# Altium project CLP.PrjPCB
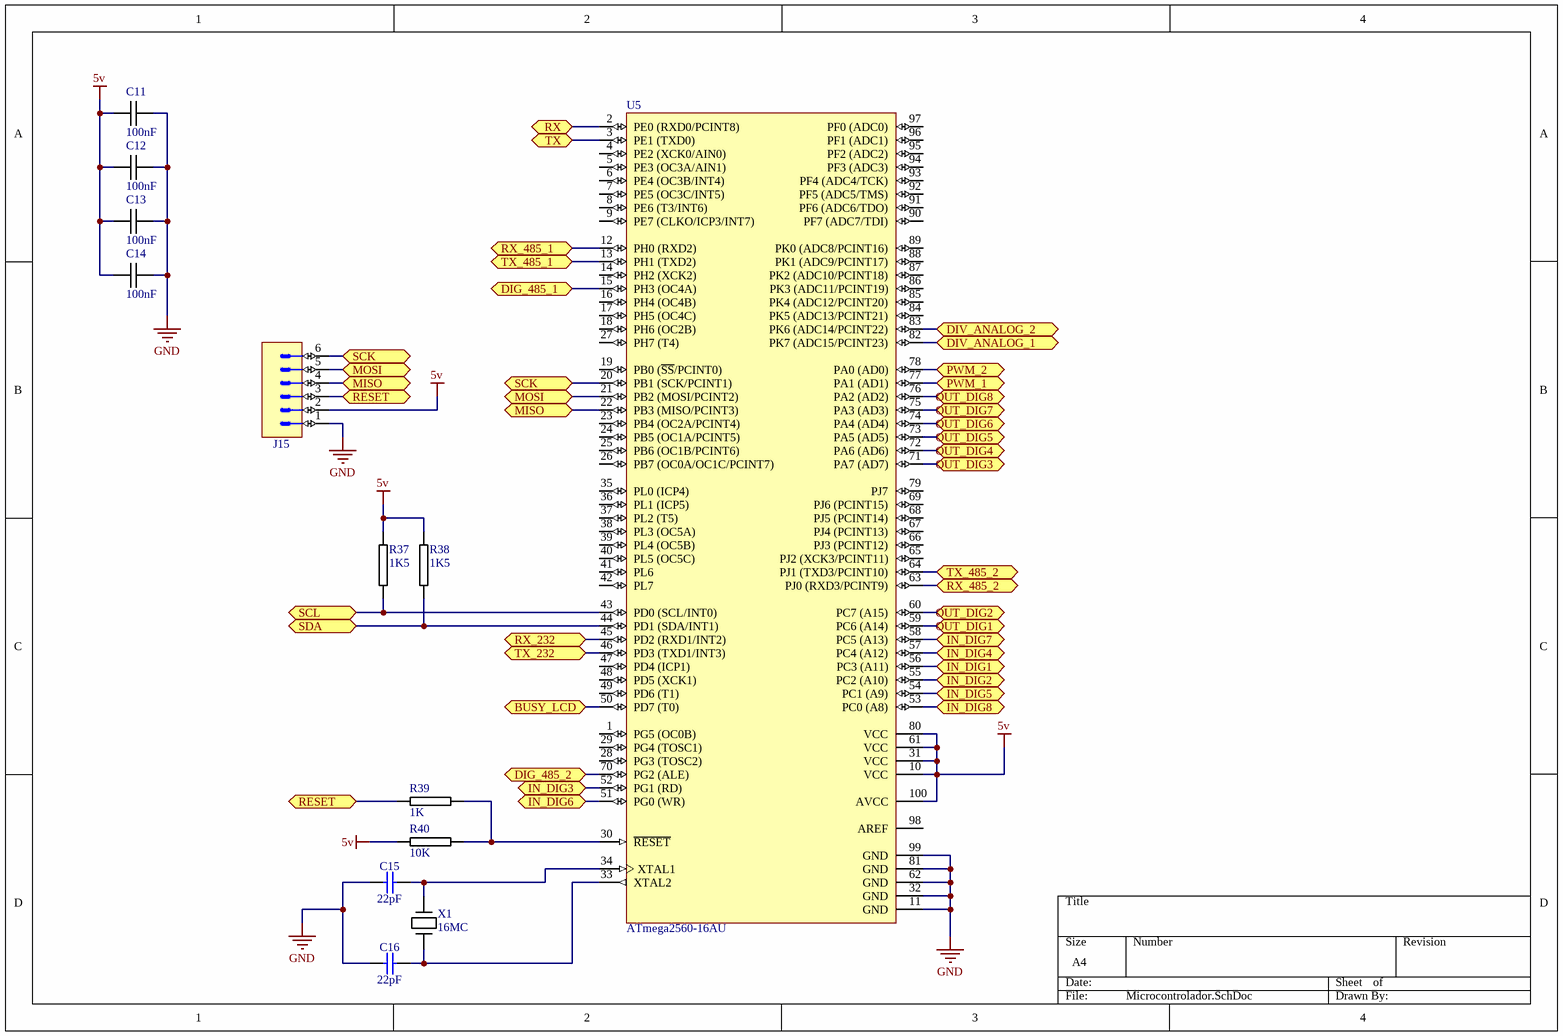
[diagram p0: Microcontrolador.SchDoc]
11 sheets, 159 parts. Net scope: flat (ports and power ports of the same name join across sheets).
Board file: CLP_007.PcbDoc
Sheets:
  Microcontrolador.SchDoc
  Alimentacao.SchDoc
  Output_dig.SchDoc
  Output_dig2.SchDoc
  Input_dig.SchDoc
  Comu_485.SchDoc
  USB_SERIAL.SchDoc
  eeprom24c32.SchDoc
  RTC_ds1307z.SchDoc
  analog.SchDoc
  conn.SchDoc

## Sheet Microcontrolador.SchDoc
size A4; DocumentNumber: 1; SheetNumber: 1; SheetTotal: 11

### Parts
C11  100nF  [0805C-TBD]
C12  100nF  [0805C-TBD]
C13  100nF  [0805C-TBD]
C14  100nF  [0805C-TBD]
C15  22pF  [CAPC2012X135N]
C16  22pF  [CAPC2012X135N]
J15  KK®  [MOLEX_22-27-2061]  (value not drawn)
R37  1K5  [0805R-1K5]
R38  1K5  [0805R-1K5]
R39  1K  [0805R-1K]
R40  10K  [0805R-10K]
U5  ATmega2560-16AU  [100A_N]
X1  16MC  [XTAL-RU49/4]

### Ports
BUSY_LCD, DIG_485_1 (bidir), DIG_485_2 (bidir), DIV_ANALOG_1, DIV_ANALOG_2, IN_DIG1, IN_DIG2, IN_DIG3, IN_DIG4, IN_DIG5, IN_DIG6, IN_DIG7, IN_DIG8, MISO, MOSI, OUT_DIG1, OUT_DIG2, OUT_DIG3, OUT_DIG4, OUT_DIG5, OUT_DIG6, OUT_DIG7, OUT_DIG8, PWM_1, PWM_2, RESET, RX, RX_232, RX_485_1, RX_485_2, SCK, SCL, SDA, TX, TX_232, TX_485_1 (bidir), TX_485_2 (bidir)

### Nets
5v: C11.1 C12.1 C13.1 C14.1 J15.2 R37.1 R38.1 R40.1 U5.10(VCC) U5.31(VCC) U5.61(VCC) U5.80(VCC) U5.100(AVCC)
GND: C11.2 C12.2 C13.2 C14.2 C15.1 C16.1 J15.1 U5.11(GND) U5.32(GND) U5.62(GND) U5.81(GND) U5.99(GND)
NetC15_2: C15.2 U5.34(XTAL1) X1.1
NetC16_2: C16.2 U5.33(XTAL2) X1.2
NetC19_2: J15.3 R39.1 ; port RESET
NetIC2_6: U5.56(PC3_(A11)) ; port IN_DIG1
NetIC3_6: U5.54(PC1_(A9)) ; port IN_DIG5
NetIC4_6: U5.55(PC2_(A10)) ; port IN_DIG2
NetIC5_6: U5.51(PG0_(WR)) ; port IN_DIG6
NetIC6_6: U5.52(PG1_(RD)) ; port IN_DIG3
NetIC7_6: U5.58(PC5_(A13)) ; port IN_DIG7
NetIC8_6: U5.57(PC4_(A12)) ; port IN_DIG4
NetIC9_6: U5.53(PC0_(A8)) ; port IN_DIG8
NetIC12_1: U5.59(PC6_(A14)) ; port OUT_DIG1
NetIC12_3: U5.60(PC7_(A15)) ; port OUT_DIG2
NetIC12_5: U5.71(PA7_(AD7)) ; port OUT_DIG3
NetIC12_9: U5.72(PA6_(AD6)) ; port OUT_DIG4
NetIC21_1: U5.73(PA5_(AD5)) ; port OUT_DIG5
NetIC21_3: U5.74(PA4_(AD4)) ; port OUT_DIG6
NetIC21_5: U5.75(PA3_(AD3)) ; port OUT_DIG7
NetIC21_9: U5.76(PA2_(AD2)) ; port OUT_DIG8
NetJ6_7: U5.50(PD7_(T0)) ; port BUSY_LCD
NetJ15_4: J15.4 U5.22(PB3_(MISO/PCINT3)) ; port MISO
NetJ15_5: J15.5 U5.21(PB2_(MOSI/PCINT2)) ; port MOSI
NetJ15_6: J15.6 U5.20(PB1_(SCK/PCINT1)) ; port SCK
NetR6_1: U5.46(PD3_(TXD1/INT3)) ; port TX_232
NetR10_1: U5.45(PD2_(RXD1/INT2)) ; port RX_232
NetR37_2: R37.2 U5.43(PD0_(SCL/INT0)) ; port SCL
NetR38_2: R38.2 U5.44(PD1_(SDA/INT1)) ; port SDA
NetR39_2: R39.2 R40.2 U5.30(~{RESET})
NetR54_2: U5.2(PE0_(RXD0/PCINT8)) ; port RX
NetR56_2: U5.3(PE1_(TXD0)) ; port TX
NetR58_1: U5.77(PA1_(AD1)) ; port PWM_1
NetR61_1: U5.78(PA0_(AD0)) ; port PWM_2
NetR62_1: U5.82(PK7_(ADC15/PCINT23)) ; port DIV_ANALOG_1
NetR63_1: U5.83(PK6_(ADC14/PCINT22)) ; port DIV_ANALOG_2
NetU2_1: U5.12(PH0_(RXD2)) ; port RX_485_1
NetU2_2: U5.15(PH3_(OC4A)) ; port DIG_485_1
NetU2_4: U5.13(PH1_(TXD2)) ; port TX_485_1
NetU3_1: U5.63(PJ0_(RXD3/PCINT9)) ; port RX_485_2
NetU3_2: U5.70(PG2_(ALE)) ; port DIG_485_2
NetU3_4: U5.64(PJ1_(TXD3/PCINT10)) ; port TX_485_2

Not connected (* = marked no-connect by the designer): U5 1(PG5_(OC0B)) 4(PE2_(XCK0/AIN0)) 5(PE3_(OC3A/AIN1)) 6(PE4_(OC3B/INT4)) 7(PE5_(OC3C/INT5)) 8(PE6_(T3/INT6)) 9(PE7_(CLKO/ICP3/INT7)) 14(PH2_(XCK2)) 16(PH4_(OC4B)) 17(PH5_(OC4C)) 18(PH6_(OC2B)) 19(PB0_(~{SS}/PCINT0)) 23(PB4_(OC2A/PCINT4)) 24(PB5_(OC1A/PCINT5)) 25(PB6_(OC1B/PCINT6)) 26(PB7_(OC0A/OC1C/PCINT7)) 27(PH7_(T4)) 28(PG3_(TOSC2)) 29(PG4_(TOSC1)) 35(PL0_(ICP4)) 36(PL1_(ICP5)) 37(PL2_(T5)) 38(PL3_(OC5A)) 39(PL4_(OC5B)) 40(PL5_(OC5C)) 41(PL6) 42(PL7) 47(PD4_(ICP1)) 48(PD5_(XCK1)) 49(PD6_(T1)) 65(PJ2_(XCK3/PCINT11)) 66(PJ3_(PCINT12)) 67(PJ4_(PCINT13)) 68(PJ5_(PCINT14)) 69(PJ6_(PCINT15)) 79(PJ7) 84(PK5_(ADC13/PCINT21)) 85(PK4_(ADC12/PCINT20)) 86(PK3_(ADC11/PCINT19)) 87(PK2_(ADC10/PCINT18)) 88(PK1_(ADC9/PCINT17)) 89(PK0_(ADC8/PCINT16)) 90(PF7_(ADC7/TDI)) 91(PF6_(ADC6/TDO)) 92(PF5_(ADC5/TMS)) 93(PF4_(ADC4/TCK)) 94(PF3_(ADC3)) 95(PF2_(ADC2)) 96(PF1_(ADC1)) 97(PF0_(ADC0)) 98(AREF)

### Library data of the parts
C11-C14 = 0805C-100nF-25V-X7R-MUR: CAPACITOR 0805 CERAMIC; Supplier 1: Digi-Key; Supplier Part Number 1: 490-1673-1-ND
C15 C16 = CC0805_22PF_50V_5%_NP0: Non-polarised capacitor; Part Description: SMD Multilayer Chip Ceramic Capacitor; Manufacturer: GENERIC; Manufacturer1 Part Number: 223886115229; Voltage: 50V; TC: NP0; Tolerance: ±5%; Table: Capacitors SMD; Part Number: CC0805_22PF_50V_5%_NP0; Component Kind: Standard; Component Type: Standard; Pin Count: 2; Value: 22pF; Status: Preferred; Manufacturer Part Number: CC0805_22PF_50V_5%_NP0; Case: 0805; Mounted: Yes; Socket: No; SMD: Yes; Manufacturer1 Example: PHYCOMP; Manufacturer1 ComponentHeight: 1.35mm; HelpURL: \\cern.ch\dfs\Applications\Altium\Datasheets\CC0805_NP0_PHYCOMP.pdf; Author: CERN DEM JLC; CreateDate: 03/12/2007; LatestRevisionDate: 03/12/2007
J15 = MOLEX_22-27-2061: Connector 6 Male; Part Description: 2.54mm (.100") Pitch KK® Wire-to-Board Header, Vertical, with Friction Lock, 6 Circuits, Tin (Sn) Plating; Manufacturer: MOLEX; Part Number: MOLEX_22-27-2061; Component Kind: Standard; Component Type: Standard; Pin Count: 6; Family: KK®; Mounted: Yes; Socket: No; SMD: No; Status: None; Manufacturer Part Number: 22-27-2061; ComponentHeight: 11.7mm; HelpURL: \\cern.ch\dfs\Applications\Altium\Datasheets\MOLEX_22-27-2061.pdf; Author: CERN DEM JMW; CreateDate: 30/11/2011; LatestRevisionDate: 30/11/2011; Table: MOLEX
R37 R38 = 0805R-1K5: RESISTOR 0805 1/4 WATT THIN FILM; Reel: *
R39 = 0805R-1K: RESISTOR 0805 1/4 WATT THIN FILM; Reel: *
R40 = 0805R-10K: RESISTOR 0805 1/4 WATT THIN FILM; Reel: *
U5 = ATmega2560-16AU: 8-bit AVR Microcontroller, 4.5-5.5V, 16MHz, 256KB Flash, 4KB EEPROM, 8KB SRAM, 86 GPIO pins, 100-pin TQFP, Industrial Grade (-40°C to 85°C), Pb-Free; DatasheetVersion: revN, May-2011; PackageVersion: revD, Oct-2010; PackageReference: 100A; PackageDescription: 100-Pin Thin Profile Plastic Quad Flat Pack (TQFP), 14 x 14 x 1.0 mm Body, 0.5 mm Pitch; Code_JEDEC: MS-026-AED; ComponentLink1Description: Manufacturer URL; ComponentLink1URL: http://www.atmel.com/; ComponentLink2Description: ATmega640/1280/1281/2560/2561 Datasheet; ComponentLink2URL: http://www.atmel.com/dyn/resources/prod_documents/doc2549.pdf; ComponentLink3Description: ATmega640/1280/1281/2560/2561 Summary; ComponentLink3URL: http://www.atmel.com/dyn/resources/prod_documents/2549S.pdf
X1 = 16MC-HC49US: 16MHZ CRSYTAL HC49US; Supplier 1: Mouser; Supplier Part Number 1: 815-ABLS-16.0M-T

## Sheet Alimentacao.SchDoc
size A4; DocumentNumber: 8; SheetNumber: 8; SheetTotal: 11
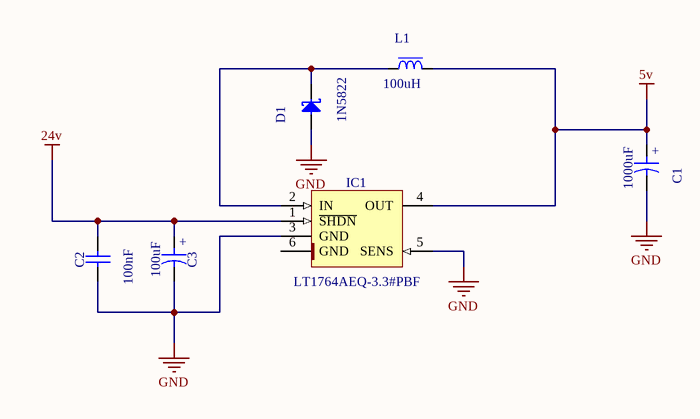
[diagram p1: Alimentacao.SchDoc]

### Parts
C1  1000uF  [CAPPR500-1350X2200]
C2  100nF  [CAPC2012X135N]
C3  100uF  [CAPPR500-1050X1750]
D1  1N5822  [DO-201AD]
IC1  LT1764AEQ-3.3#PBF  [TO170P1394X457-6N-R900X1060]
L1  100uH  [IND_WURTH_WE-PD4_L]

### Nets
5v: C1.1 IC1.4(OUT) L1.2
24v: C2.2 C3.1 IC1.1(~{SHDN})
GND: C1.2 C2.1 C3.2 D1.2(A) IC1.3(GND) IC1.5(SENS)
NetD1_1: D1.1(C) IC1.2(IN) L1.1

Not connected (* = marked no-connect by the designer): IC1 6(GND)

### Notes on the sheet
- (in symbol CAER_100UF_63V_20%_500-1050X1750_LESR0R190) +
- (in symbol CAER_1000UF_35V_20%_VISHAY_MAL203850102E3) +

### Library data of the parts
C1 = CAER_1000UF_35V_20%_VISHAY_MAL203850102E3: Polarised capacitor; Part Description: Radial Standard Ultra Miniature Aluminum Electrolytic Capacitor (038 RSU Series); Manufacturer: VISHAY BCCOMPONENTS; Voltage: 35V; Tolerance: ±20%; Table: Capacitors THD; Part Number: CAER_1000UF_35V_20%_VISHAY_MAL203850102E3; Component Kind: Standard; Component Type: Standard; Pin Count: 2; Value: 1000uF; Status: None; Manufacturer Part Number: MAL203850102E3; Case: LS5 D13.5 x H22; Mounted: Yes; Socket: No; SMD: No; ComponentHeight: 22mm; HelpURL: \\cern.ch\dfs\Applications\Altium\Datasheets\CAER_VISHAY_038 RSU.pdf; Author: CERN DEM JLC; CreateDate: 11/04/2012; LatestRevisionDate: 11/04/2012
C2 = CC0805_100NF_50V_10%_X7R: Non-polarised capacitor; Part Description: SMD Multilayer Chip Ceramic Capacitor; Manufacturer: GENERIC; Manufacturer1 Part Number: B37941K5104K62; Voltage: 50V; TC: X7R; Tolerance: ±10%; Table: Capacitors SMD; Part Number: CC0805_100NF_50V_10%_X7R; Component Kind: Standard; Component Type: Standard; Pin Count: 2; Value: 100nF; Status: Preferred; Manufacturer Part Number: CC0805_100NF_50V_10%_X7R; Case: 0805; Mounted: Yes; Socket: No; SMD: Yes; Manufacturer1 Example: EPCOS; Manufacturer1 ComponentHeight: 1.35mm; HelpURL: \\cern.ch\dfs\Applications\Altium\Datasheets\CC0805_X7R_EPCOS.pdf; Author: CERN DEM JLC; CreateDate: 03/12/2007; LatestRevisionDate: 03/12/2007
C3 = CAER_100UF_63V_20%_500-1050X1750_LESR0R190: Polarised capacitor; Part Description: Low ESR 0R190 Aluminum Electrolytic Capacitor; Manufacturer: VISHAY BCCOMPONENTS; Manufacturer Part Number: MAL213668101E3 Series 136RVI; Voltage: 63V; Tolerance: ±20%; Table: Capacitors THD; Part Number: CAER_100UF_63V_20%_500-1050X1750_LESR0R190; Component Kind: Standard; Component Type: Standard; Pin Count: 2; Value: 100uF; Status: Preferred; Case: LS5 D10.5 x H17.5; Mounted: Yes; Socket: No; SMD: No; ComponentHeight: 17.5mm; HelpURL: \\cern.ch\dfs\Applications\Altium\Datasheets\CAER-LESR_VISHAY_136RVI.pdf; Author: CERN DEM JLC; CreateDate: 03/07/2008; LatestRevisionDate: 16/03/2009
D1 = 1N5822: Schottky Diode; Part Description: Schottky Rectifier; Manufacturer: FAIRCHILD SEMICONDUCTOR; Voltage: 40V; Power: 3A; Table: Diodes; Part Number: 1N5822; Component Kind: Standard; Component Type: Standard; Device: 1N5822; PackageDescription: DO-201AD, Diode, Axial; Lead Spacing 20.32mm, Lead Dia. 1.3mm, Body Length 9.5mm, Body Dia. 5.6mm; Manufacturer Part Number: 1N5822; Pin Count: 2; Case: DO-201AD; Mounted: Yes; Socket: No; SMD: No; ComponentHeight: 5.6mm; HelpURL: \\cern.ch\dfs\Applications\Altium\Datasheets\1N5822.pdf; Author: CERN DEM JLC; CreateDate: 31/03/2009; LatestRevisionDate: 31/03/2009
IC1 = LT1764AEQ-3.3#PBF: 3A, Fast Transient Response, Low Noise, LDO Regulators; Manufacturer: LINEAR TECHNOLOGY; Part Number: LT1764AEQ-3.3#PBF; Component Kind: Standard; Component Type: Standard; Device: LT1764AEQ-3.3#PBF; PackageDescription: TO, 1.70mm Pitch; 5 Pin, 13.945mm L X 8.89mm W X 4.572mm H body, IPC Medium Density; Part Description: 3A, Fast Transient Response, Low Noise, LDO Regulators; Manufacturer Part Number: LT1764AEQ-3.3#PBF; Pin Count: 6; Case: TO-263; Mounted: Yes; Socket: No; SMD: Yes; ComponentHeight: 4.57mm; HelpURL: \\cern.ch\dfs\Applications\Altium\Datasheets\LT1764AEQ-3.3#PBF.pdf; Author: CERN DEM JLC; CreateDate: 27/03/2012; LatestRevisionDate: 27/03/2012; Table: Regulators
L1 = IND_3.3UH_20%_WURTH_WE-PD4_74456033: Inductor With Magnetic core; Part Description: Power Choke (WE-PD 4 Serie); Manufacturer: WURTH ELEKTRONIK; Value: 3.3uH; Power: 5.3A; Resistance: 0.015R; Tolerance: ±20%; Table: Inductors SMD; Part Number: IND_3.3UH_20%_WURTH_WE-PD4_74456033; Component Kind: Standard; Component Type: Standard; Pin Count: 2; Status: None; Manufacturer Part Number: 74456033; Mounted: Yes; Socket: No; SMD: Yes; ComponentHeight: 5.3mm; HelpURL: \\cern.ch\dfs\Applications\Altium\Datasheets\IND_WURTH_WE-PD4_74456033.pdf; Author: CERN DEM JLC; CreateDate: 07/06/2011; LatestRevisionDate: 24/01/2012

## Sheet Output_dig.SchDoc
size A4; DocumentNumber: 2; SheetNumber: 2; SheetTotal: 11
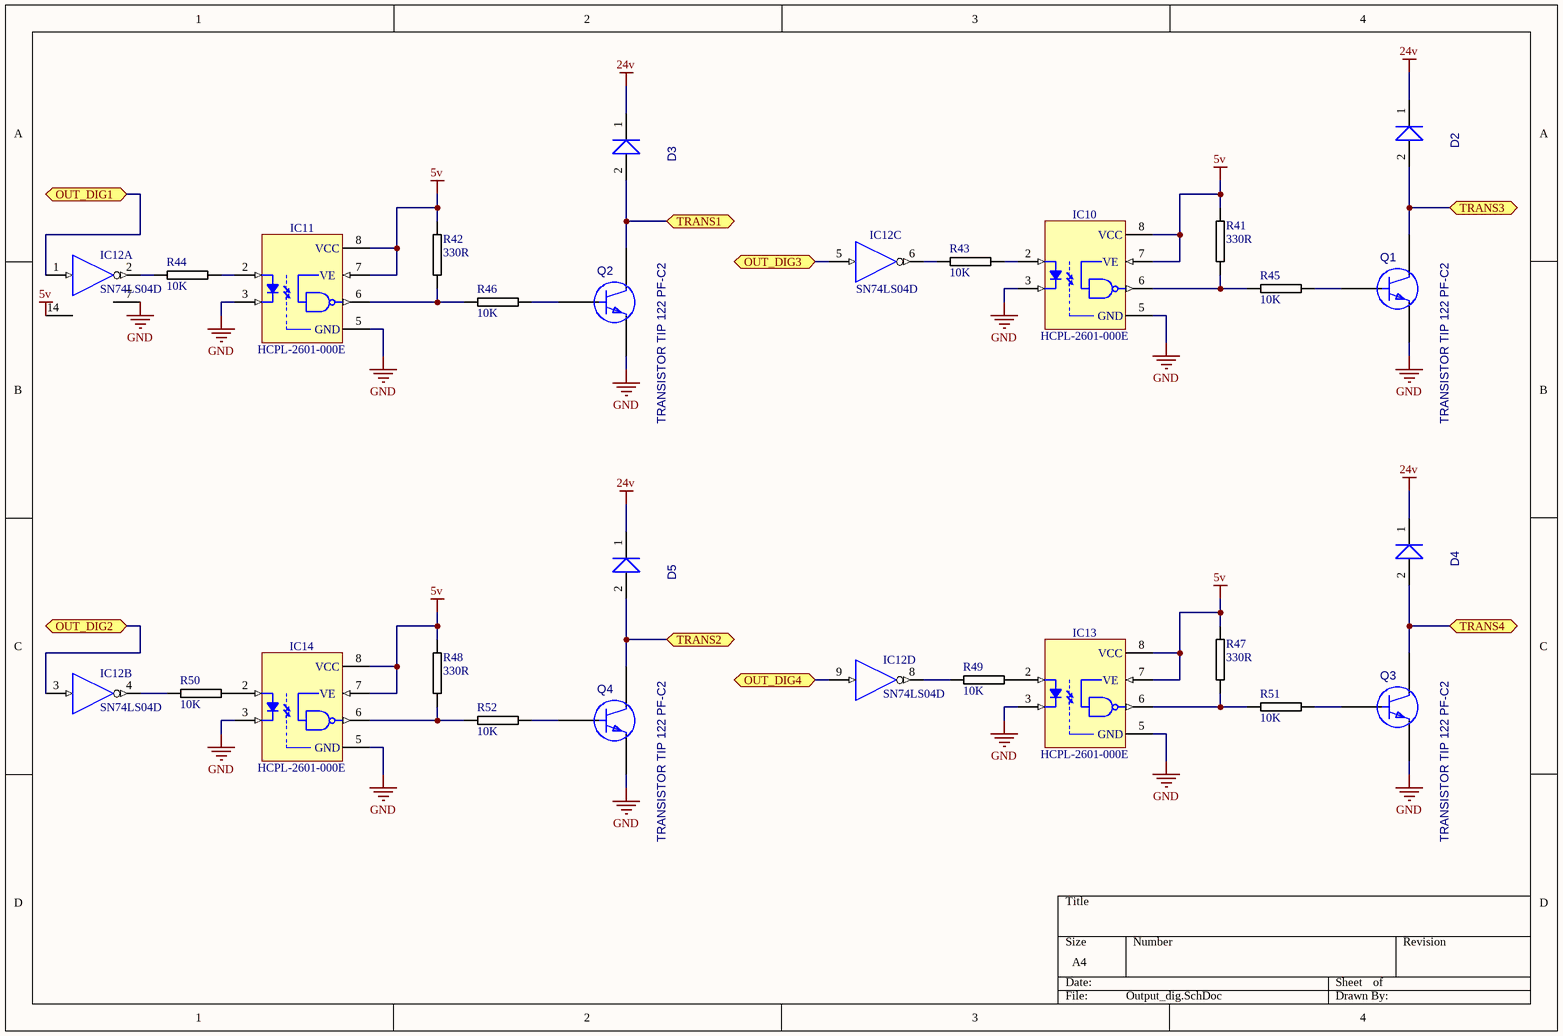
[diagram p2: Output_dig.SchDoc]

### Parts
D2  DIODO 1N4007 PF-B1  [DIODO DO41 PF-B1]  (value not drawn)
D3  DIODO 1N4007 PF-B1  [DIODO DO41 PF-B1]  (value not drawn)
D4  DIODO 1N4007 PF-B1  [DIODO DO41 PF-B1]  (value not drawn)
D5  DIODO 1N4007 PF-B1  [DIODO DO41 PF-B1]  (value not drawn)
IC10  HCPL-2601-000E  [DIP8-300]
IC11  HCPL-2601-000E  [DIP8-300]
IC12  SN74LS04D  [SOIC127P600X175-14N]  (parts A,B,C,D of 6)
IC13  HCPL-2601-000E  [DIP8-300]
IC14  HCPL-2601-000E  [DIP8-300]
Q1  TRANSISTOR TIP 122 PF-C2  [TRANSISTOR TO220 PF-C2]
Q2  TRANSISTOR TIP 122 PF-C2  [TRANSISTOR TO220 PF-C2]
Q3  TRANSISTOR TIP 122 PF-C2  [TRANSISTOR TO220 PF-C2]
Q4  TRANSISTOR TIP 122 PF-C2  [TRANSISTOR TO220 PF-C2]
R41  330R  [0805R-330]
R42  330R  [0805R-330]
R43  10K  [0805R-10K]
R44  10K  [0805R-10K]
R45  10K  [0805R-10K]
R46  10K  [0805R-10K]
R47  330R  [0805R-330]
R48  330R  [0805R-330]
R49  10K  [0805R-10K]
R50  10K  [0805R-10K]
R51  10K  [0805R-10K]
R52  10K  [0805R-10K]

### Ports
OUT_DIG1, OUT_DIG2, OUT_DIG3, OUT_DIG4, TRANS1, TRANS2, TRANS3, TRANS4

### Nets
5v: IC10.7(VE) IC10.8(VCC) IC11.7(VE) IC11.8(VCC) IC12.14(5v) IC13.7(VE) IC13.8(VCC) IC14.7(VE) IC14.8(VCC) R41.1 R42.1 R47.1 R48.1
24v: D2.1(K) D3.1(K) D4.1(K) D5.1(K)
GND: IC10.3(K) IC10.5(GND) IC11.3(K) IC11.5(GND) IC12.7(GND) IC13.3(K) IC13.5(GND) IC14.3(K) IC14.5(GND) Q1.3(E) Q2.3(E) Q3.3(E) Q4.3(E)
VCC: IC12.14(VCC)
NetD2_2: D2.2(A) Q1.2(C) ; port TRANS3
NetD3_2: D3.2(A) Q2.2(C) ; port TRANS1
NetD4_2: D4.2(A) Q3.2(C) ; port TRANS4
NetD5_2: D5.2(A) Q4.2(C) ; port TRANS2
NetIC10_2: IC10.2(A) R43.2
NetIC10_6: IC10.6(VO) R41.2 R45.1
NetIC11_2: IC11.2(A) R44.2
NetIC11_6: IC11.6(VO) R42.2 R46.1
NetIC12_1: IC12.1(A) ; port OUT_DIG1
NetIC12_2: IC12.2(~{O}) R44.1
NetIC12_3: IC12.3(A) ; port OUT_DIG2
NetIC12_4: IC12.4(~{O}) R50.1
NetIC12_5: IC12.5(A) ; port OUT_DIG3
NetIC12_6: IC12.6(~{O}) R43.1
NetIC12_8: IC12.8(~{O}) R49.1
NetIC12_9: IC12.9(A) ; port OUT_DIG4
NetIC13_2: IC13.2(A) R49.2
NetIC13_6: IC13.6(VO) R47.2 R51.1
NetIC14_2: IC14.2(A) R50.2
NetIC14_6: IC14.6(VO) R48.2 R52.1
NetQ1_1: Q1.1(B) R45.2
NetQ2_1: Q2.1(B) R46.2
NetQ3_1: Q3.1(B) R51.2
NetQ4_1: Q4.1(B) R52.2

### Library data of the parts
D2-D5 = DIODO 1N4007 PF-B1: cod: 606000120; Compra: 302003193; 3D comp: DIODO DO41 PF-B1; Descri: DIODO 1N4007 PF-B1; SCH: DIODO 1N4007 PF-B1
IC10 IC11 IC13 IC14 = HCPL-2601-000E: Single Optocoupler; Part Description: High CMR, High Speed TTL Compatible Optocouplers; Manufacturer: AVAGO TECHNOLOGIES; Table: Optocouplers; Part Number: HCPL-2601-000E; Component Kind: Standard; Component Type: Standard; Device: HCPL-2601-000E; PackageDescription: DIP; 8 Leads; Row Spacing 7.62 mm; Pitch 2.54 mm; Manufacturer Part Number: HCPL-2601-000E; Pin Count: 8; Case: DIP8-300; Mounted: Yes; Socket: Yes; SMD: No; ComponentHeight: 4.7mm; HelpURL: \\cern.ch\dfs\Applications\Altium\Datasheets\HCPL-2601-000E.pdf; Author: CERN DEM JLC; CreateDate: 30/03/2009; LatestRevisionDate: 30/03/2009
IC12 = SN74LS04D: Hex Inverter; Part Description: Hex Inverters; Manufacturer: TEXAS INSTRUMENTS; Table: Standard Logic; Part Number: SN74LS04D; Component Kind: Standard; Component Type: Standard; Device: SN74LS04D; PackageDescription: SOIC 14, Pitch 1.27mm - Body 4x8.75mm, IPC Medium Density; Manufacturer Part Number: SN74LS04D; Pin Count: 14; Case: SOIC14; Mounted: Yes; Socket: No; SMD: Yes; ComponentHeight: 1.75mm; Author: CERN DEM JLC; HelpURL: \\cern.ch\dfs\Applications\Altium\Datasheets\SN74LS04D.pdf; CreateDate: 20/05/2010; LatestRevisionDate: 20/05/2010
Q1-Q4 = TRANSISTOR TIP 122 PF-C2: cod: 606000213; Compra: 302003328; 3D comp: TRANSISTOR TO220 PF-C2; Descri: TRANSISTOR TIP 122 PF-C2; SCH: TRANSISTOR TIP 122 PF-C2
R41 R42 R47 R48 = 0805R-330: RESISTOR 0805 1/4 WATT THIN FILM; Reel: *
R43-R46 R49-R52 = 0805R-10K: RESISTOR 0805 1/4 WATT THIN FILM; Reel: *

## Sheet Output_dig2.SchDoc
size A4
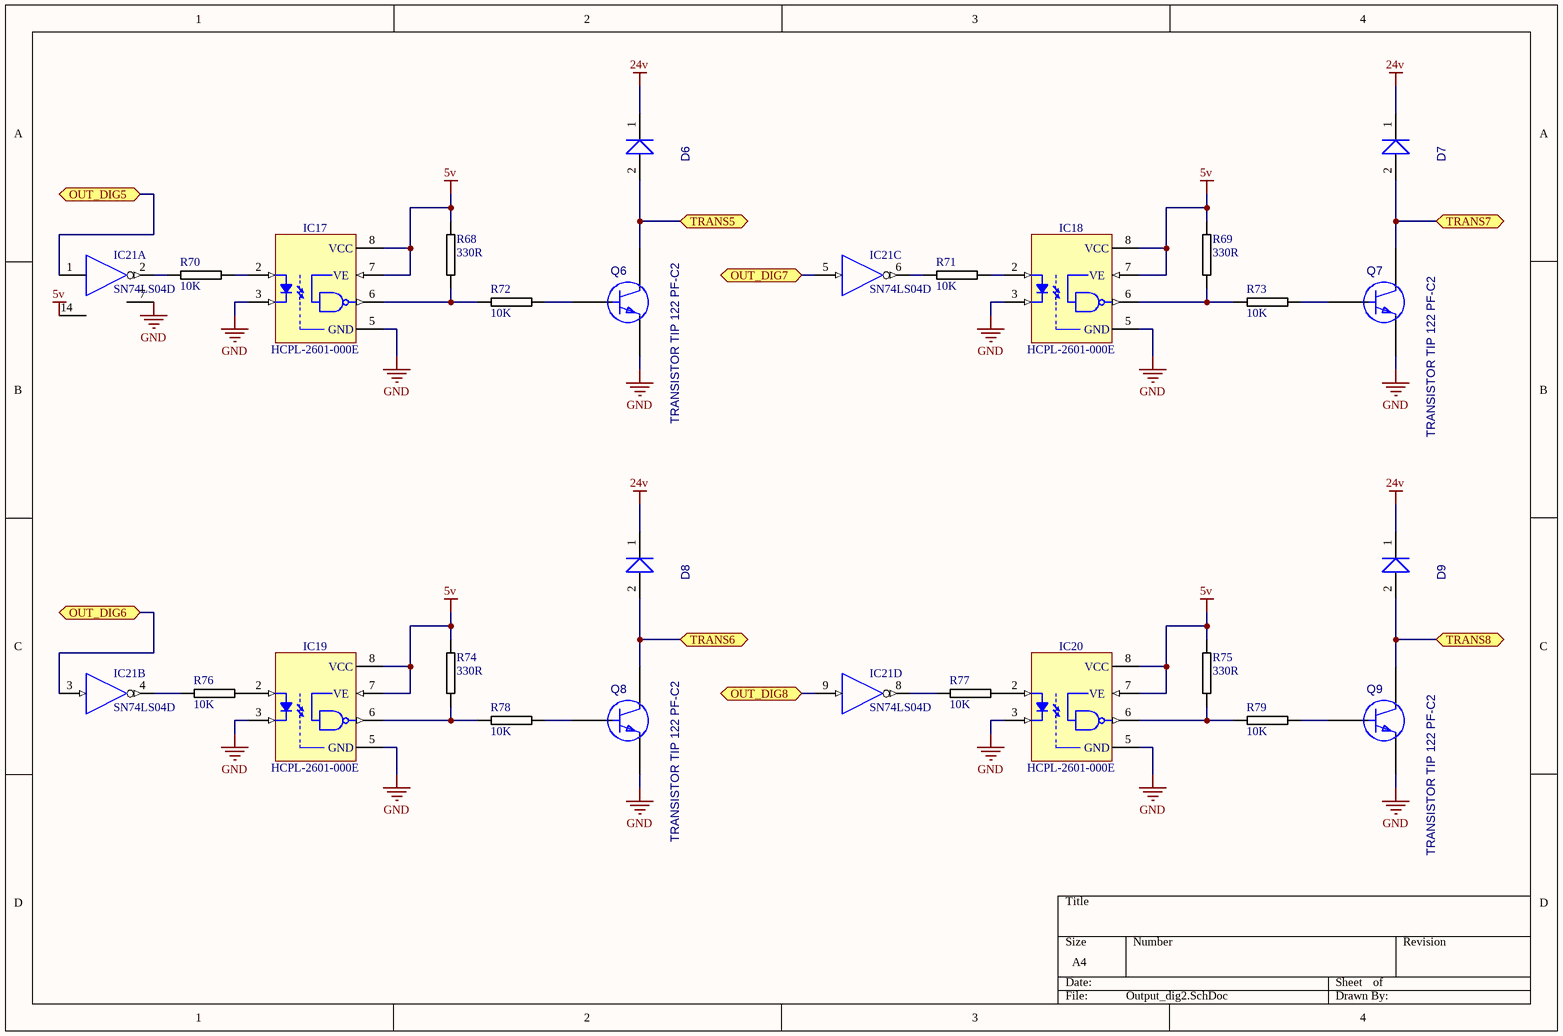
[diagram p3: Output_dig2.SchDoc]

### Parts
D6  DIODO 1N4007 PF-B1  [DIODO DO41 PF-B1]  (value not drawn)
D7  DIODO 1N4007 PF-B1  [DIODO DO41 PF-B1]  (value not drawn)
D8  DIODO 1N4007 PF-B1  [DIODO DO41 PF-B1]  (value not drawn)
D9  DIODO 1N4007 PF-B1  [DIODO DO41 PF-B1]  (value not drawn)
IC17  HCPL-2601-000E  [DIP8-300]
IC18  HCPL-2601-000E  [DIP8-300]
IC19  HCPL-2601-000E  [DIP8-300]
IC20  HCPL-2601-000E  [DIP8-300]
IC21  SN74LS04D  [SOIC127P600X175-14N]  (parts A,B,C,D of 6)
Q6  TRANSISTOR TIP 122 PF-C2  [TRANSISTOR TO220 PF-C2]
Q7  TRANSISTOR TIP 122 PF-C2  [TRANSISTOR TO220 PF-C2]
Q8  TRANSISTOR TIP 122 PF-C2  [TRANSISTOR TO220 PF-C2]
Q9  TRANSISTOR TIP 122 PF-C2  [TRANSISTOR TO220 PF-C2]
R68  330R  [0805R-330]
R69  330R  [0805R-330]
R70  10K  [0805R-10K]
R71  10K  [0805R-10K]
R72  10K  [0805R-10K]
R73  10K  [0805R-10K]
R74  330R  [0805R-330]
R75  330R  [0805R-330]
R76  10K  [0805R-10K]
R77  10K  [0805R-10K]
R78  10K  [0805R-10K]
R79  10K  [0805R-10K]

### Ports
OUT_DIG5, OUT_DIG6, OUT_DIG7, OUT_DIG8, TRANS5, TRANS6, TRANS7, TRANS8

### Nets
5v: IC17.7(VE) IC17.8(VCC) IC18.7(VE) IC18.8(VCC) IC19.7(VE) IC19.8(VCC) IC20.7(VE) IC20.8(VCC) IC21.14(VCC) R68.1 R69.1 R74.1 R75.1
24v: D6.1(K) D7.1(K) D8.1(K) D9.1(K)
GND: IC17.3(K) IC17.5(GND) IC18.3(K) IC18.5(GND) IC19.3(K) IC19.5(GND) IC20.3(K) IC20.5(GND) IC21.7(GND) Q6.3(E) Q7.3(E) Q8.3(E) Q9.3(E)
VCC: IC21.14(VCC)
NetD6_2: D6.2(A) Q6.2(C) ; port TRANS5
NetD7_2: D7.2(A) Q7.2(C) ; port TRANS7
NetD8_2: D8.2(A) Q8.2(C) ; port TRANS6
NetD9_2: D9.2(A) Q9.2(C) ; port TRANS8
NetIC17_2: IC17.2(A) R70.2
NetIC17_6: IC17.6(VO) R68.2 R72.1
NetIC18_2: IC18.2(A) R71.2
NetIC18_6: IC18.6(VO) R69.2 R73.1
NetIC19_2: IC19.2(A) R76.2
NetIC19_6: IC19.6(VO) R74.2 R78.1
NetIC20_2: IC20.2(A) R77.2
NetIC20_6: IC20.6(VO) R75.2 R79.1
NetIC21_1: IC21.1(A) ; port OUT_DIG5
NetIC21_2: IC21.2(~{O}) R70.1
NetIC21_3: IC21.3(A) ; port OUT_DIG6
NetIC21_4: IC21.4(~{O}) R76.1
NetIC21_5: IC21.5(A) ; port OUT_DIG7
NetIC21_6: IC21.6(~{O}) R71.1
NetIC21_8: IC21.8(~{O}) R77.1
NetIC21_9: IC21.9(A) ; port OUT_DIG8
NetQ6_1: Q6.1(B) R72.2
NetQ7_1: Q7.1(B) R73.2
NetQ8_1: Q8.1(B) R78.2
NetQ9_1: Q9.1(B) R79.2

### Library data of the parts
D6-D9 = DIODO 1N4007 PF-B1: cod: 606000120; Compra: 302003193; 3D comp: DIODO DO41 PF-B1; Descri: DIODO 1N4007 PF-B1; SCH: DIODO 1N4007 PF-B1
IC17-IC20 = HCPL-2601-000E: as IC10 on sheet Output_dig; Part Number: HCPL-2601-000E; Component Kind: Standard; Component Type: Standard; Device: HCPL-2601-000E; PackageDescription: DIP; 8 Leads; Row Spacing 7.62 mm; Pitch 2.54 mm; Manufacturer Part Number: HCPL-2601-000E; Pin Count: 8; Case: DIP8-300; Mounted: Yes; Socket: Yes; SMD: No; ComponentHeight: 4.7mm; HelpURL: \\cern.ch\dfs\Applications\Altium\Datasheets\HCPL-2601-000E.pdf; Author: CERN DEM JLC; CreateDate: 30/03/2009; LatestRevisionDate: 30/03/2009
IC21 = SN74LS04D: as IC12 on sheet Output_dig; Part Number: SN74LS04D; Component Kind: Standard; Component Type: Standard; Device: SN74LS04D; PackageDescription: SOIC 14, Pitch 1.27mm - Body 4x8.75mm, IPC Medium Density; Manufacturer Part Number: SN74LS04D; Pin Count: 14; Case: SOIC14; Mounted: Yes; Socket: No; SMD: Yes; ComponentHeight: 1.75mm; Author: CERN DEM JLC; HelpURL: \\cern.ch\dfs\Applications\Altium\Datasheets\SN74LS04D.pdf; CreateDate: 20/05/2010; LatestRevisionDate: 20/05/2010
Q6-Q9 = TRANSISTOR TIP 122 PF-C2: cod: 606000213; Compra: 302003328; 3D comp: TRANSISTOR TO220 PF-C2; Descri: TRANSISTOR TIP 122 PF-C2; SCH: TRANSISTOR TIP 122 PF-C2
R68 R69 R74 R75 = 0805R-330: RESISTOR 0805 1/4 WATT THIN FILM; Reel: *
R70-R73 R76-R79 = 0805R-10K: RESISTOR 0805 1/4 WATT THIN FILM; Reel: *

## Sheet Input_dig.SchDoc
size A4; DocumentNumber: 3; SheetNumber: 3; SheetTotal: 11
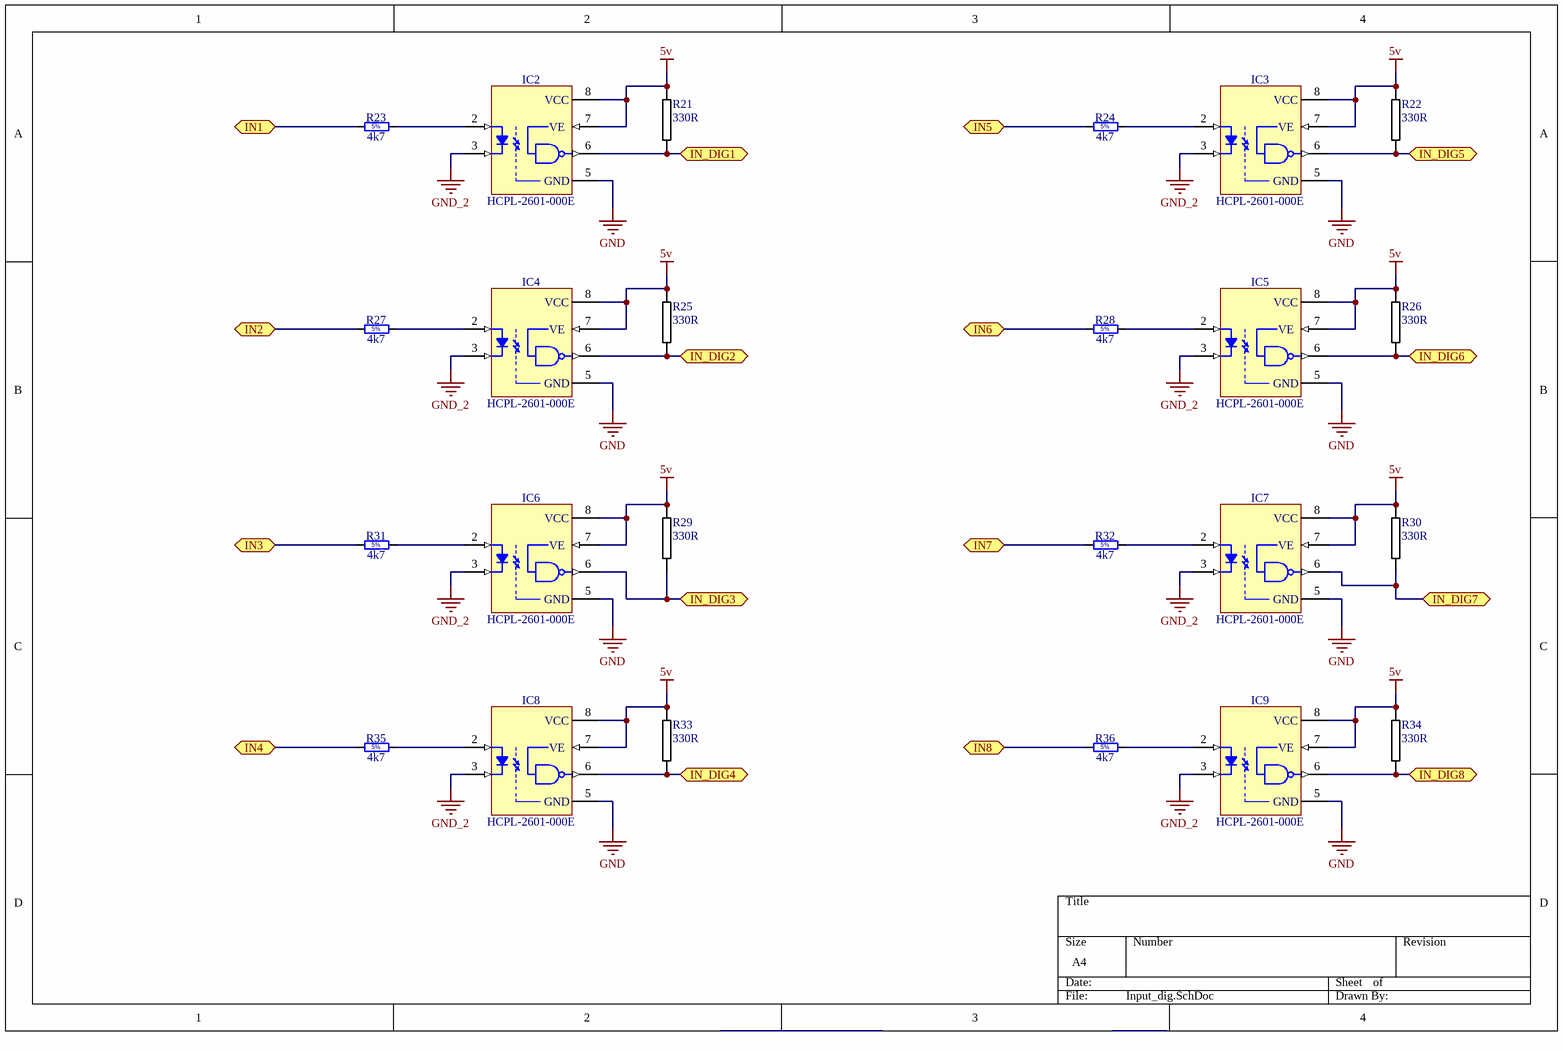
[diagram p4: Input_dig.SchDoc]

### Parts
IC2  HCPL-2601-000E  [DIP8-300]
IC3  HCPL-2601-000E  [DIP8-300]
IC4  HCPL-2601-000E  [DIP8-300]
IC5  HCPL-2601-000E  [DIP8-300]
IC6  HCPL-2601-000E  [DIP8-300]
IC7  HCPL-2601-000E  [DIP8-300]
IC8  HCPL-2601-000E  [DIP8-300]
IC9  HCPL-2601-000E  [DIP8-300]
R21  330R  [0805R-330]
R22  330R  [0805R-330]
R23  4k7  [RES2286-1670X520]
R24  4k7  [RES2286-1670X520]
R25  330R  [0805R-330]
R26  330R  [0805R-330]
R27  4k7  [RES2286-1670X520]
R28  4k7  [RES2286-1670X520]
R29  330R  [0805R-330]
R30  330R  [0805R-330]
R31  4k7  [RES2286-1670X520]
R32  4k7  [RES2286-1670X520]
R33  330R  [0805R-330]
R34  330R  [0805R-330]
R35  4k7  [RES2286-1670X520]
R36  4k7  [RES2286-1670X520]

### Ports
IN1, IN2, IN3, IN4, IN5, IN6, IN7, IN8, IN_DIG1, IN_DIG2, IN_DIG3, IN_DIG4, IN_DIG5, IN_DIG6, IN_DIG7, IN_DIG8

### Nets
5v: IC2.7(VE) IC2.8(VCC) IC3.7(VE) IC3.8(VCC) IC4.7(VE) IC4.8(VCC) IC5.7(VE) IC5.8(VCC) IC6.7(VE) IC6.8(VCC) IC7.7(VE) IC7.8(VCC) IC8.7(VE) IC8.8(VCC) IC9.7(VE) IC9.8(VCC) R21.1 R22.1 R25.1 R26.1 R29.1 R30.1 R33.1 R34.1
GND: IC2.5(GND) IC3.5(GND) IC4.5(GND) IC5.5(GND) IC6.5(GND) IC7.5(GND) IC8.5(GND) IC9.5(GND)
GND_2: IC2.3(K) IC3.3(K) IC4.3(K) IC5.3(K) IC6.3(K) IC7.3(K) IC8.3(K) IC9.3(K)
NetIC2_2: IC2.2(A) R23.2
NetIC2_6: IC2.6(VO) R21.2 ; port IN_DIG1
NetIC3_2: IC3.2(A) R24.2
NetIC3_6: IC3.6(VO) R22.2 ; port IN_DIG5
NetIC4_2: IC4.2(A) R27.2
NetIC4_6: IC4.6(VO) R25.2 ; port IN_DIG2
NetIC5_2: IC5.2(A) R28.2
NetIC5_6: IC5.6(VO) R26.2 ; port IN_DIG6
NetIC6_2: IC6.2(A) R31.2
NetIC6_6: IC6.6(VO) R29.2 ; port IN_DIG3
NetIC7_2: IC7.2(A) R32.2
NetIC7_6: IC7.6(VO) R30.2 ; port IN_DIG7
NetIC8_2: IC8.2(A) R35.2
NetIC8_6: IC8.6(VO) R33.2 ; port IN_DIG4
NetIC9_2: IC9.2(A) R36.2
NetIC9_6: IC9.6(VO) R34.2 ; port IN_DIG8
NetJ7_2: R23.1 ; port IN1
NetJ7_3: R27.1 ; port IN2
NetJ7_4: R31.1 ; port IN3
NetJ7_5: R35.1 ; port IN4
NetJ8_2: R24.1 ; port IN5
NetJ8_3: R28.1 ; port IN6
NetJ8_4: R32.1 ; port IN7
NetJ8_5: R36.1 ; port IN8

### Notes on the sheet
- (in symbol RMF_4K7_5%_3W_250PPM_2286-1670X520) 5%

### Library data of the parts
IC2-IC9 = HCPL-2601-000E: as IC10 on sheet Output_dig; Part Number: HCPL-2601-000E; Component Kind: Standard; Component Type: Standard; Device: HCPL-2601-000E; PackageDescription: DIP; 8 Leads; Row Spacing 7.62 mm; Pitch 2.54 mm; Manufacturer Part Number: HCPL-2601-000E; Pin Count: 8; Case: DIP8-300; Mounted: Yes; Socket: Yes; SMD: No; ComponentHeight: 4.7mm; HelpURL: \\cern.ch\dfs\Applications\Altium\Datasheets\HCPL-2601-000E.pdf; Author: CERN DEM JLC; CreateDate: 30/03/2009; LatestRevisionDate: 30/03/2009
R21 R22 R25 R26 R29 R30 R33 R34 = 0805R-330: RESISTOR 0805 1/4 WATT THIN FILM; Reel: *
R23 R24 R27 R28 R31 R32 R35 R36 = RMF_4K7_5%_3W_250PPM_2286-1670X520: Resistor - 5%; Part Description: Leaded Power Metal Film Resistor; Manufacturer: GENERIC; Manufacturer1 Part Number: PR03000204701JAC00; Power: 3W; TC: ±250ppm/°C; Table: Resistors THD; Part Number: RMF_4K7_5%_3W_250PPM_2286-1670X520; Component Kind: Standard; Component Type: Standard; Pin Count: 2; Value: 4k7; Status: Preferred; Tolerance: ±5%; Manufacturer Part Number: RMF_4K7_5%_3W_250PPM_2286-1670X520; Case: LS22.86 L16.7 x D5.2; Mounted: Yes; Socket: No; SMD: No; ComponentHeight: 5.2mm; Manufacturer1 Example: VISHAY BCCOMPONENT; Manufacturer1 ComponentHeight: 5.2mm; HelpURL: \\cern.ch\dfs\Applications\Altium\Datasheets\RMF_VISHAY_PR03.pdf; Author: CERN DEM JLC; CreateDate: 19/06/2008; LatestRevisionDate: 01/10/2012

## Sheet Comu_485.SchDoc
size A4; DocumentNumber: 5; SheetNumber: 5; SheetTotal: 11
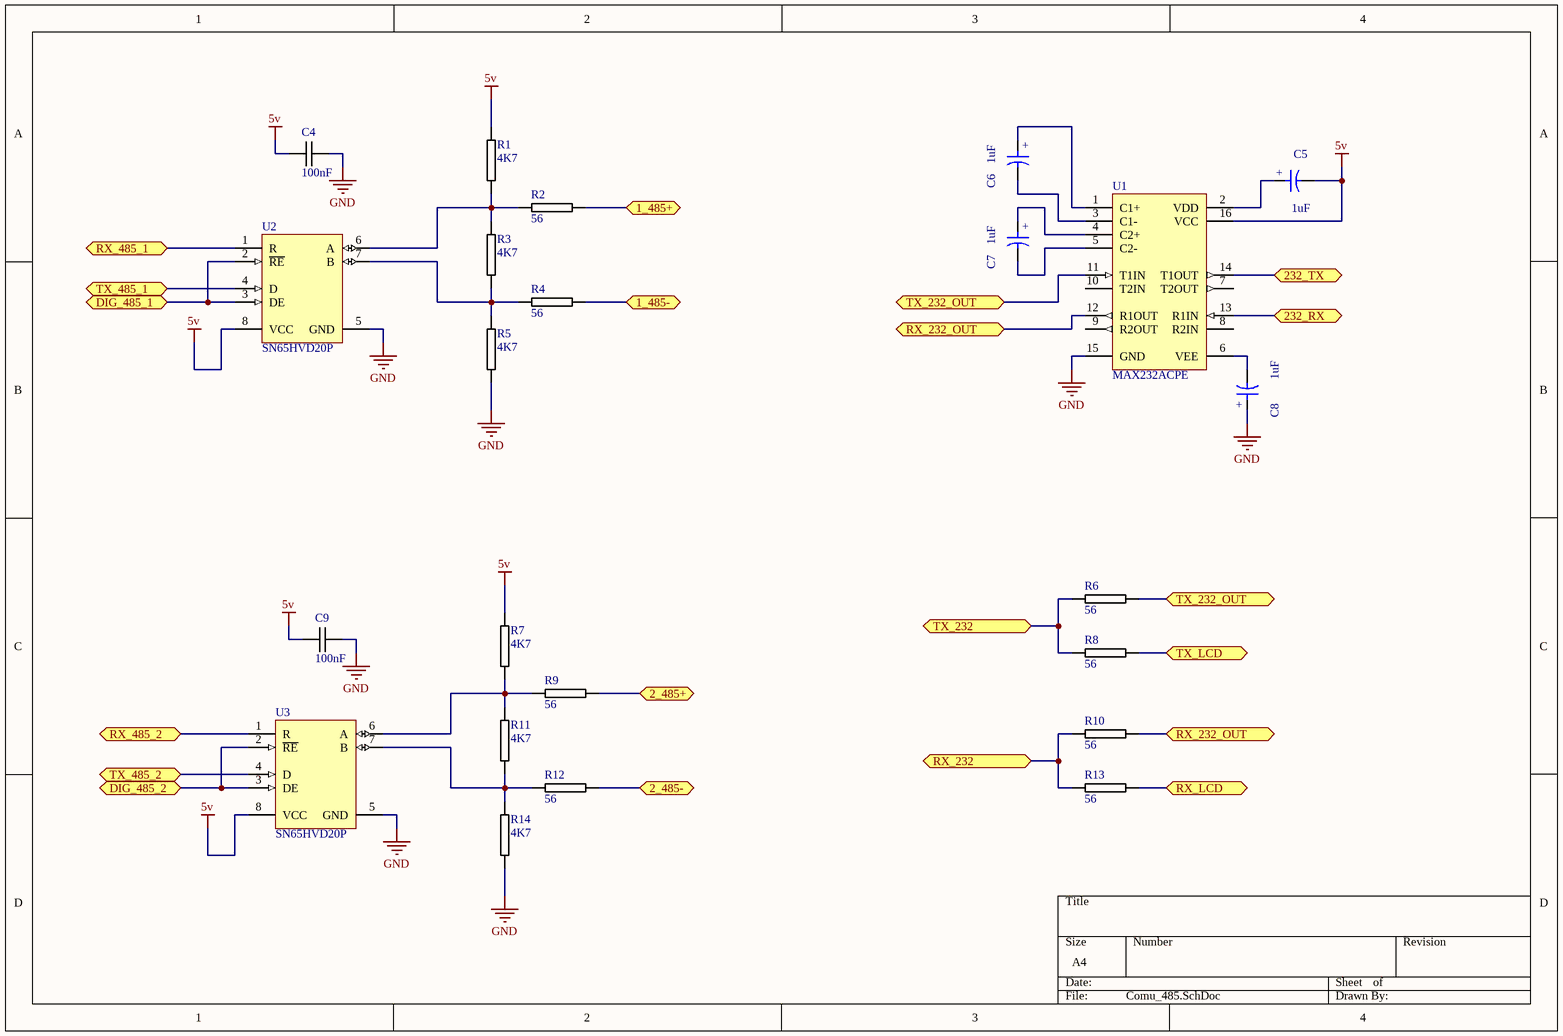
[diagram p5: Comu_485.SchDoc]

### Parts
C4  100nF  [0805C-TBD]
C5  1uF  [CAPPRB254-450X710]
C6  1uF  [CAPPRB254-450X710]
C7  1uF  [CAPPRB254-450X710]
C8  1uF  [CAPPRB254-450X710]
C9  100nF  [0805C-TBD]
R1  4K7  [0805R-4K7]
R2  56  [0805R-56]
R3  4K7  [0805R-4K7]
R4  56  [0805R-56]
R5  4K7  [0805R-4K7]
R6  56  [0805R-56]
R7  4K7  [0805R-4K7]
R8  56  [0805R-56]
R9  56  [0805R-56]
R10  56  [0805R-56]
R11  4K7  [0805R-4K7]
R12  56  [0805R-56]
R13  56  [0805R-56]
R14  4K7  [0805R-4K7]
U1  MAX232ACPE  [PE16A]
U2  SN65HVD20P  [P8]
U3  SN65HVD20P  [P8]

### Ports
1_485+, 1_485-, 2_485+, 2_485-, 232_RX, 232_TX, DIG_485_1 (bidir), DIG_485_2 (bidir), RX_232, RX_232_OUT, RX_485_1, RX_485_2, RX_LCD, TX_232, TX_232_OUT, TX_485_1 (bidir), TX_485_2 (bidir), TX_LCD

### Nets
5v: C4.1 C5.2 C9.1 R1.1 R7.1 U1.16(VCC) U2.8(VCC) U3.8(VCC)
GND: C4.2 C8.1 C9.2 R5.2 R14.2 U1.15(GND) U2.5(GND) U3.5(GND)
NetC5_1: C5.1 U1.2(VDD)
NetC6_1: C6.1 U1.1(C1+)
NetC6_2: C6.2 U1.3(C1-)
NetC7_1: C7.1 U1.4(C2+)
NetC7_2: C7.2 U1.5(C2-)
NetC8_2: C8.2 U1.6(VEE)
NetJ2_2: U1.13(R1IN) ; port 232_RX
NetJ2_3: U1.14(T1OUT) ; port 232_TX
NetJ3_1: R2.2 ; port 1_485+
NetJ3_2: R4.2 ; port 1_485-
NetJ4_2: R9.2 ; port 2_485+
NetJ4_3: R12.2 ; port 2_485-
NetJ6_5: R8.2 ; port TX_LCD
NetJ6_6: R13.2 ; port RX_LCD
NetR1_2: R1.2 R2.1 R3.1 U2.6(A)
NetR3_2: R3.2 R4.1 R5.1 U2.7(B)
NetR6_1: R6.1 R8.1 ; port TX_232
NetR6_2: R6.2 U1.11(T1IN) ; port TX_232_OUT
NetR7_2: R7.2 R9.1 R11.1 U3.6(A)
NetR10_1: R10.1 R13.1 ; port RX_232
NetR10_2: R10.2 U1.12(R1OUT) ; port RX_232_OUT
NetR11_2: R11.2 R12.1 R14.1 U3.7(B)
NetU2_1: U2.1(R) ; port RX_485_1
NetU2_2: U2.2(~{RE}) U2.3(DE) ; port DIG_485_1
NetU2_4: U2.4(D) ; port TX_485_1
NetU3_1: U3.1(R) ; port RX_485_2
NetU3_2: U3.2(~{RE}) U3.3(DE) ; port DIG_485_2
NetU3_4: U3.4(D) ; port TX_485_2

Not connected (* = marked no-connect by the designer): U1 7(T2OUT) 8(R2IN) 9(R2OUT) 10(T2IN)

### Notes on the sheet
- (in symbol CTEB_1UF_35V_10%_254-450X710) +

### Library data of the parts
C4 C9 = 0805C-100nF-25V-X7R-MUR: CAPACITOR 0805 CERAMIC; Supplier 1: Digi-Key; Supplier Part Number 1: 490-1673-1-ND
C5-C8 = CTEB_1UF_35V_10%_254-450X710: Polarised capacitor; Part Description: Solid Tantalum Resin Dipped Capacitor; Manufacturer: KEMET; Manufacturer Part Number: T350A105K035AT; Voltage: 35V; Tolerance: ±10%; Table: Capacitors THD; Part Number: CTEB_1UF_35V_10%_254-450X710; Component Kind: Standard; Component Type: Standard; Pin Count: 2; Value: 1uF; Status: None; Case: LS2.54 D4.5 x H7.1; Mounted: Yes; Socket: No; SMD: No; ComponentHeight: 7.1mm; HelpURL: \\cern.ch\dfs\Applications\Altium\Datasheets\CTEB_KEMET_T350.pdf; Author: CERN DEM JLC; CreateDate: 16/12/2009; LatestRevisionDate: 16/12/2009
R1 R3 R5 R7 R11 R14 = 0805R-4K7: RESISTOR 0805 1/4 WATT THIN FILM; Reel: *
R2 R4 R6 R8-R10 R12 R13 = 0805R-56: RESISTOR 0805 1/4 WATT THIN FILM; Reel: *
U1 = MAX232ACPE: +5V Powered, Multi-Channel RS-232 Driver/Receiver; Published: 16-Jan-2001; LatestRevisionDate: 29-May-2009; LatestRevisionNote: Component Body Added.; PackageVersion: 1997; PackageReference: PE16A; Publisher: Altium Limited; PackageDescription: DIP, 16-Pin, Row Spacing 7.62 mm, Pitch 2.54 mm; Code_JEDEC: MS-001-BB; ComponentLink1Description: Manufacturer Link; ComponentLink1URL: http://www.maxim-ic.com/; ComponentLink2Description: Datasheet; ComponentLink2URL: http://pdfserv.maxim-ic.com/en/ds/MAX220-MAX249.pdf
U2 U3 = SN65HVD20P: Extended Common-mode RS-485 Transceiver, 25 Mbps, 5 V, Half Duplex, -40 to 85 degC, 8-pin PDIP (P), Pb-Free (RoHS); Manufacturer: Texas Instruments; Eco-Plan: Green (RoHS & no Sb/Br); # of TX/RX: 1 TX / 1 RX; Drivers Per Package: 1; Isolated: No; Number of Nodes: 64; Signaling Rate(Mbps): 25; Common Mode Range: -20 to 25; ESD(kV): 16; Fault Protection(V): -27 to 27; Fail Safe: Idle, Open, Short; ICC(Max)(mA): 9; Supply Voltage(s)(V): 5; Rating: Catalog; DatasheetVersion: SLLS552E; PackageVersion: revE, Apr-2010; PackageReference: P8; PackageDescription: 8-Pin Plastic Dual-In-Line Package, Row Spacing 7.62 mm, Pitch 2.54 mm; Supplier 1: Digi-Key; Supplier Part Number 1: SN65HVD20P-ND; Supplier 2: Mouser; Supplier Part Number 2: 595-SN65HVD20P; SubFamily: RS-485; Receivers Per Package: 1; Duplex: Half; Footprint: SN75176; Mounting Technology: Through-hole; PartNumber: SN65HVD20P; Code_JEDEC: MS-001-BA; ComponentLink1Description: Datasheet; ComponentLink1URL: http://www.ti.com/general/docs/lit/getliterature.tsp?genericPartNumber=SN65HVD20&fileType=pdf; ComponentLink2Description: Package Specification; ComponentLink2URL: http://www.ti.com/litv/pdf/mpdi001b

## Sheet USB_SERIAL.SchDoc
size A4; DocumentNumber: 6; SheetNumber: 6; SheetTotal: 11
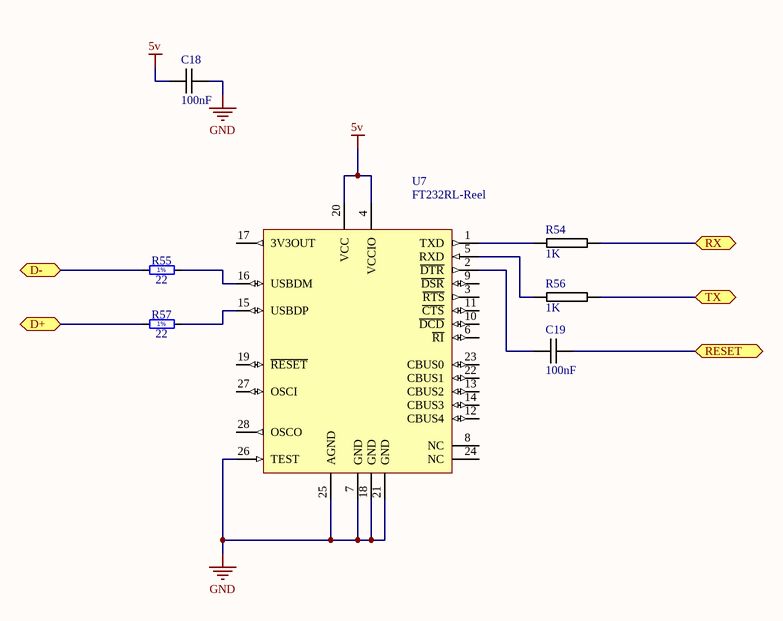
[diagram p6: USB_SERIAL.SchDoc]

### Parts
C18  100nF  [0805C-TBD]
C19  100nF  [0805C-TBD]
R54  1K  [0805R-1K]
R55  22  [RESC2012X60N]
R56  1K  [0805R-1K]
R57  22  [RESC2012X60N]
U7  FT232RL-Reel  [SSOP-28_N]

### Ports
D+, D-, RESET, RX, TX

### Nets
5v: C18.1 U7.4(VCCIO) U7.20(VCC)
GND: C18.2 U7.7(GND) U7.18(GND) U7.21(GND) U7.25(AGND) U7.26(TEST)
NetC19_1: C19.1 U7.2(~{DTR})
NetC19_2: C19.2 ; port RESET
NetJ5_2: R57.1 ; port D+
NetJ5_3: R55.1 ; port D-
NetR54_1: R54.1 U7.1(TXD)
NetR54_2: R54.2 ; port RX
NetR55_2: R55.2 U7.16(USBDM)
NetR56_1: R56.1 U7.5(RXD)
NetR56_2: R56.2 ; port TX
NetR57_2: R57.2 U7.15(USBDP)

Not connected (* = marked no-connect by the designer): U7 3(~{RTS}) 6(~{RI}) 8(NC) 9(~{DSR}) 10(~{DCD}) 11(~{CTS}) 12(CBUS4) 13(CBUS2) 14(CBUS3) 17(3V3OUT) 19(~{RESET}) 22(CBUS1) 23(CBUS0) 24(NC) 27(OSCI) 28(OSCO)

### Notes on the sheet
- (in symbol R0805_22R_1%_0.125W_100PPM) 1%

### Library data of the parts
C18 C19 = 0805C-100nF-25V-X7R-MUR: CAPACITOR 0805 CERAMIC; Supplier 1: Digi-Key; Supplier Part Number 1: 490-1673-1-ND
R54 R56 = 0805R-1K: RESISTOR 0805 1/4 WATT THIN FILM; Reel: *
R55 R57 = R0805_22R_1%_0.125W_100PPM: Resistor - 1%; Part Description: General Purpose Thick Film Chip Resistor; Manufacturer: GENERIC; Manufacturer1 Part Number: NRC10F22R0TRF; Power: 0.125W; TC: ±100ppm/°C; Table: Resistors SMD; Part Number: R0805_22R_1%_0.125W_100PPM; Component Kind: Standard; Component Type: Standard; Pin Count: 2; Value: 22; Status: Preferred; Tolerance: ±1%; Manufacturer Part Number: R0805_22R_1%_0.125W_100PPM; Case: 0805; Mounted: Yes; Socket: No; SMD: Yes; Manufacturer1 Example: NIC COMPONENT; Manufacturer1 ComponentHeight: 0.6mm; HelpURL: \\cern.ch\dfs\Applications\Altium\Datasheets\R0805_NIC_NRC.pdf; Author: CERN DEM JLC; CreateDate: 03/12/2007; LatestRevisionDate: 13/03/2008
U7 = FT232RL-Reel: USB UART Asynchronous Serial Data Transfer Chip, 28-pin SSOP, Tape and Reel; Manufacturer: FTDI; DatasheetVersion: ver 2.10, Mar-2012; PackageVersion: Mar-12; PackageReference: SSOP-28; PackageDescription: 28-Pin Small Outline Package 0.65 mm Pitch; PartNumber: FT232RL-Reel; ComponentLink1Description: Manufacturer URL; ComponentLink1URL: http://www.ftdichip.com/; ComponentLink2Description: Datasheet; ComponentLink2URL: http://www.ftdichip.com/Support/Documents/DataSheets/ICs/DS_FT232R.pdf

## Sheet eeprom24c32.SchDoc
size A4; DocumentNumber: 7; SheetNumber: 7; SheetTotal: 11
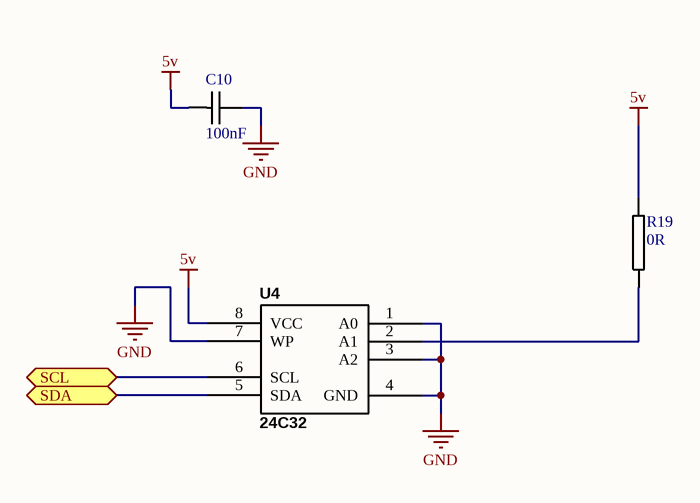
[diagram p7: eeprom24c32.SchDoc]

### Parts
C10  100nF  [0805C-TBD]
R19  0R  [0805R-GENERIC]
U4  24C32  [SO8]

### Ports
SCL, SDA

### Nets
5v: C10.1 R19.2 U4.8(VCC)
GND: C10.2 U4.1(A0) U4.3(A2) U4.4(GND) U4.7(WP)
NetR19_1: R19.1 U4.2(A1)
NetR37_2: U4.6(SCL) ; port SCL
NetR38_2: U4.5(SDA) ; port SDA

### Library data of the parts
C10 = 0805C-100nF-25V-X7R-MUR: CAPACITOR 0805 CERAMIC; Supplier 1: Digi-Key; Supplier Part Number 1: 490-1673-1-ND
R19 = 0805R-0R: RESISTOR 0805 1 WATT
U4 = 24C32: I2C EEPROM 4K X 8; Part Field 1: STM; Manufacturer Part Number: M24C32-WMN6TP; Manufacturer: STMicroelectronics; Description: IC EEPROM 32KBIT 400KHZ 8SOIC; Reel: U3; Part Field 2: M24C32-WMN6TP; Part Field 3: Digi-Key; Part Field 4: 497-5027-6-ND; Part Field 5: SERIAL I2C EEPROM; Supplier 1: Digi-Key; Supplier Part Number 1: 497-5027-2-ND

## Sheet RTC_ds1307z.SchDoc
size A4; DocumentNumber: 9; SheetNumber: 9; SheetTotal: 11
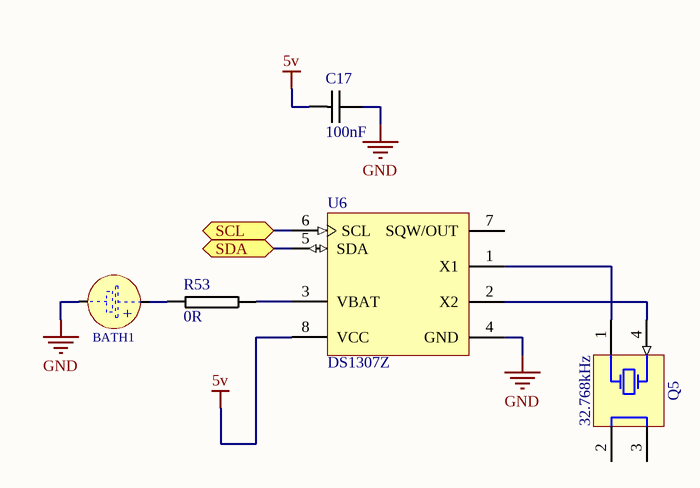
[diagram p8: RTC_ds1307z.SchDoc]

### Parts
BATH1  (no value)  [BATH_KEYSTONE_103]
C17  100nF  [0805C-TBD]
Q5  32.768kHz  [XTAL_EPSON_MC-406]
R53  0R  [0805R-GENERIC]
U6  DS1307Z  [S8-2_N]

### Ports
SCL, SDA

### Nets
5v: C17.1 U6.8(VCC)
GND: BATH1.2(MINUS) C17.2 U6.4(GND)
NetBATH1_1: BATH1.1(PLUS) R53.1
NetQ5_1: Q5.1(X) U6.1(X1)
NetQ5_4: Q5.4(X) U6.2(X2)
NetR37_2: U6.6(SCL) ; port SCL
NetR38_2: U6.5(SDA) ; port SDA
NetR53_2: R53.2 U6.3(VBAT)

Not connected (* = marked no-connect by the designer): Q5 2(GND) 3(GND); U6 7(SQW/OUT)

### Notes on the sheet
- (in symbol BATH_KEYSTONE_103) +

### Library data of the parts
BATH1 = BATH_KEYSTONE_103: Battery Holder whit 2 Pin; Part Description: Battery Holders for 20mm Lithium Coin Cells; Manufacturer Part Number: 103; Table: Batteries; Part Number: BATH_KEYSTONE_103; Component Kind: Standard; Component Type: Standard; Pin Count: 2; PackageDescription: Battery Holders for 20mm Lithium Coin Cells; Family: Battery; Mounted: Yes; Socket: No; SMD: No; Manufacturer: KEYSTONE; ComponentHeight: 8.5mm; HelpURL: \\cern.ch\dfs\Applications\Altium\Datasheets\BATH_KEYSTONE_103.pdf; Author: CERN DEM JLC; CreateDate: 20/10/2009; LatestRevisionDate: 20/10/2009
C17 = 0805C-100nF-25V-X7R-MUR: CAPACITOR 0805 CERAMIC; Supplier 1: Digi-Key; Supplier Part Number 1: 490-1673-1-ND
Q5 = XTAL_32.768KHZ_EPSON_MC-406 32.768K-A3:ROHS: Crystal 4 pins 1=XTAL Control 2 And 3=NC 4=XTAL; Part Description: Load capacitance 12.5pF, Frequency Tolerance ±20 ppm, 40°C to 85°C, Surface Mount Quartz Crystal, MC-406 Serie; Manufacturer: EPSON TOYOCOM; Table: Crystals & Oscillators; Part Number: XTAL_32.768KHZ_EPSON_MC-406 32.768K-A3:ROHS; Component Kind: Standard; Component Type: Standard; PackageDescription: EPSON Crystal; 10.41mm L X 4.06mm W X 3.6mm H; Value: 32.768kHz; Manufacturer Part Number: MC-406 32.768K-A3:ROHS; Pin Count: 4; Mounted: Yes; Socket: No; SMD: Yes; ComponentHeight: 3.6mm; HelpURL: \\cern.ch\dfs\Applications\Altium\Datasheets\XTAL_EPSON_MC-406.pdf; Author: CERN DEM JLC; CreateDate: 27/03/2012; LatestRevisionDate: 30/01/2013
R53 = 0805R-0R: RESISTOR 0805 1 WATT
U6 = DS1307Z: 64 x 8, Serial, I2C Real-Time Clock, 5.0V, 8-Pin SO, 0 to 70 degC; DatasheetVersion: 10-Feb-2008; PackageVersion: revC, 2010; PackageReference: S8-2; PackageDescription: 8-Pin Small-Outline IC, Narrow (0.15in), 1.27 mm Pitch, SOIC (N); Code_JEDEC: MS-012-AA; Code_IPC: SOIC127P600-8; ComponentLink1Description: Manufacturer URL; ComponentLink1URL: http://www.maxim-ic.com; ComponentLink2Description: Datasheet; ComponentLink2URL: http://datasheets.maxim-ic.com/en/ds/DS1307.pdf; ComponentLink3Description: Package Specification; ComponentLink3URL: http://pdfserv.maxim-ic.com/package_dwgs/21-0041.PDF

## Sheet analog.SchDoc
size A4
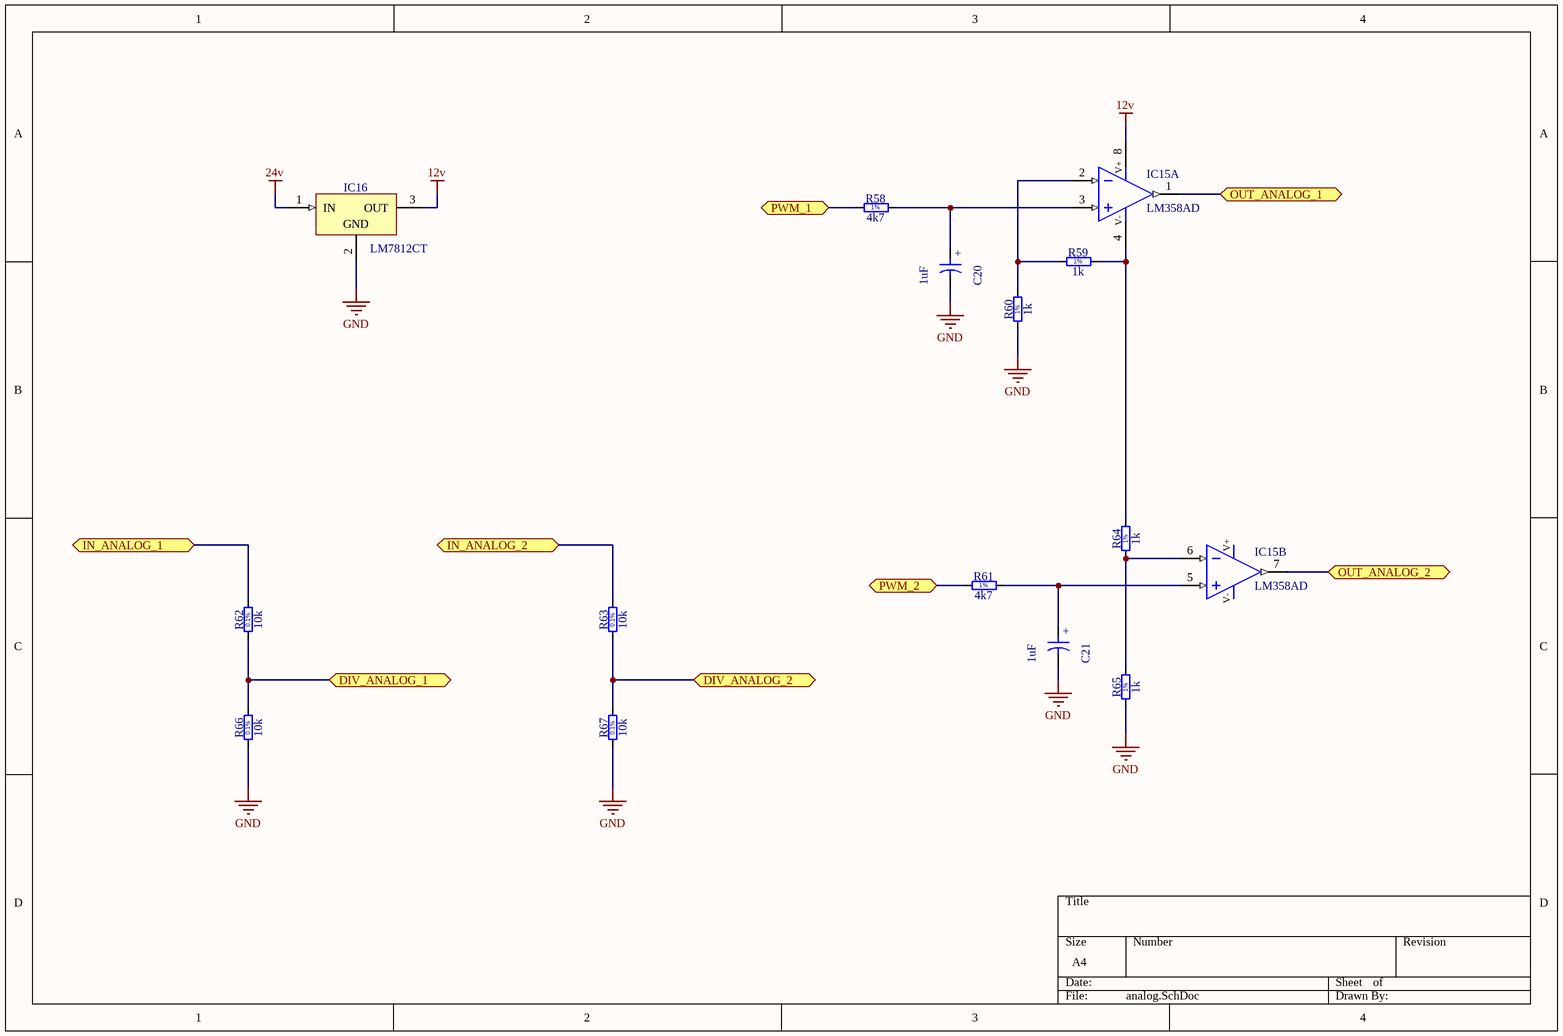
[diagram p9: analog.SchDoc]

### Parts
C20  1uF  [CAPPRB254-450X710]
C21  1uF  [CAPPRB254-450X710]
IC15  LM358AD  [SOIC127P600X175-8N]  (parts A,B of 2)
IC16  LM7812CT  [TO-220-V]
R58  4k7  [RESC2012X60N]
R59  1k  [RESC2012X60N]
R60  1k  [RESC2012X60N]
R61  4k7  [RESC2012X60N]
R62  10k  [RESC2012X60N]
R63  10k  [RESC2012X60N]
R64  1k  [RESC2012X60N]
R65  1k  [RESC2012X60N]
R66  10k  [RESC2012X60N]
R67  10k  [RESC2012X60N]

### Ports
DIV_ANALOG_1, DIV_ANALOG_2, IN_ANALOG_1, IN_ANALOG_2, OUT_ANALOG_1, OUT_ANALOG_2, PWM_1, PWM_2

### Nets
12v: IC15.8(V+) IC16.3(OUT)
24v: IC16.1(IN)
GND: C20.2 C21.2 IC16.2(GND) R60.1 R65.1 R66.1 R67.1
NetC20_1: C20.1 IC15.3(IN+) R58.2
NetC21_1: C21.1 IC15.5(IN+) R61.2
NetIC15_1: IC15.1(OUT) ; port OUT_ANALOG_1
NetIC15_2: IC15.2(IN-) R59.1 R60.2
NetIC15_4: IC15.4(V-) R59.2 R64.2
NetIC15_6: IC15.6(IN-) R64.1 R65.2
NetIC15_7: IC15.7(OUT) ; port OUT_ANALOG_2
NetJ13_2: R62.2 ; port IN_ANALOG_1
NetJ14_2: R63.2 ; port IN_ANALOG_2
NetR58_1: R58.1 ; port PWM_1
NetR61_1: R61.1 ; port PWM_2
NetR62_1: R62.1 R66.2 ; port DIV_ANALOG_1
NetR63_1: R63.1 R67.2 ; port DIV_ANALOG_2

### Notes on the sheet
- (in symbol CTEB_1UF_35V_10%_254-450X710) +
- (in symbol R0805_1K_1%_0.33W_100PPM_VISHAY_CRCW-HP) 1%
- (in symbol R0805_4K7_1%_0.125W_100PPM) 1%
- (in symbol R0805_10K_0.1%_0.1W_10PPM) 0.1%

### Library data of the parts
C20 C21 = CTEB_1UF_35V_10%_254-450X710: as C5 on sheet Comu_485; Part Number: CTEB_1UF_35V_10%_254-450X710; Component Kind: Standard; Component Type: Standard; Pin Count: 2; Value: 1uF; Status: None; Case: LS2.54 D4.5 x H7.1; Mounted: Yes; Socket: No; SMD: No; ComponentHeight: 7.1mm; HelpURL: \\cern.ch\dfs\Applications\Altium\Datasheets\CTEB_KEMET_T350.pdf; Author: CERN DEM JLC; CreateDate: 16/12/2009; LatestRevisionDate: 16/12/2009
IC15 = LM358AD: Dual Operational Amplifier; Manufacturer: TEXAS INSTRUMENTS; Table: Operational Amplifiers; Part Number: LM358AD; Component Kind: Standard; Component Type: Standard; Device: LM358AD; PackageDescription: SOIC 8, Pitch 1.27mm - Body 4x5mm, IPC Medium Density; Part Description: Dual Operational Amplifier; Manufacturer Part Number: LM358AD; Pin Count: 8; Case: SOIC8; Mounted: Yes; Socket: No; SMD: Yes; ComponentHeight: 1.75mm; Author: CERN DEM JLC; HelpURL: \\cern.ch\dfs\Applications\Altium\Datasheets\LM358AD.pdf; CreateDate: 02/12/2008; LatestRevisionDate: 13/04/2010
IC16 = LM7812CT_v: 3-Terminal Regulator 1=IN 2=GND 3=OUT; Part Description: 3-Terminal 12V 1A Positive Voltage Regulator; Manufacturer: FAIRCHILD SEMICONDUCTOR; Table: Regulators; Part Number: LM7812CT_v; Component Kind: Standard; Component Type: Standard; Device: LM7812CT; PackageDescription: TO-220 3-Terminal + Tab - Horizontal Mount; Manufacturer Part Number: LM7812CT; Pin Count: 3; Case: TO-220; Mounted: Yes; Socket: No; SMD: No; ComponentHeight: 18.95mm; HelpURL: \\cern.ch\dfs\Applications\Altium\Datasheets\LM7812CT.pdf; Author: CERN DEM JLC; CreateDate: 29/10/2008; LatestRevisionDate: 29/10/2008
R58 R61 = R0805_4K7_1%_0.125W_100PPM: Resistor - 1%; Part Description: General Purpose Thick Film Chip Resistor; Manufacturer: GENERIC; Manufacturer1 Part Number: NRC10F4701TRF; Power: 0.125W; TC: ±100ppm/°C; Table: Resistors SMD; Part Number: R0805_4K7_1%_0.125W_100PPM; Component Kind: Standard; Component Type: Standard; Pin Count: 2; Value: 4k7; Status: Preferred; Tolerance: ±1%; Manufacturer Part Number: R0805_4K7_1%_0.125W_100PPM; Case: 0805; Mounted: Yes; Socket: No; SMD: Yes; Manufacturer1 Example: NIC COMPONENT; Manufacturer1 ComponentHeight: 0.6mm; HelpURL: \\cern.ch\dfs\Applications\Altium\Datasheets\R0805_NIC_NRC.pdf; Author: CERN DEM JLC; CreateDate: 03/12/2007; LatestRevisionDate: 13/03/2008
R59 R60 R64 R65 = R0805_1K_1%_0.33W_100PPM_VISHAY_CRCW-HP: Resistor - 1%; Part Description: Pulse Proof, High Power Thick Film Chip Resistor; Manufacturer: VISHAY; Manufacturer Part Number: CRCW08051K00FKEAHP; Power: 0.33W; TC: ±100ppm/°C; Table: Resistors SMD; Part Number: R0805_1K_1%_0.33W_100PPM_VISHAY_CRCW-HP; Component Kind: Standard; Component Type: Standard; Pin Count: 2; Value: 1k; Status: None; Tolerance: ±1%; Case: 0805; Mounted: Yes; Socket: No; SMD: Yes; Manufacturer1 ComponentHeight: 0.6mm; HelpURL: \\cern.ch\dfs\Applications\Altium\Datasheets\R0805_VISHAY_CRCW-HP e3.pdf; Author: CERN DEM JLC; CreateDate: 16/06/2010; LatestRevisionDate: 16/06/2010
R62 R63 R66 R67 = R0805_10K_0.1%_0.1W_10PPM: Resistor - 0.1%; Part Description: Thin Film Chip Resistor; Manufacturer: GENERIC; Manufacturer1 Part Number: RN73C2A10KBTG; Power: 0.1W; TC: ±10ppm; Table: Resistors SMD; Part Number: R0805_10K_0.1%_0.1W_10PPM; Component Kind: Standard; Component Type: Standard; Pin Count: 2; Value: 10k; Status: Not recommended; Tolerance: ±0.1%; Manufacturer Part Number: R0805_10K_0.1%_0.1W_10PPM; Case: 0805; Mounted: Yes; Socket: No; SMD: Yes; Manufacturer1 Example: TYCO HOLSWORTHY; Manufacturer1 ComponentHeight: 0.6mm; HelpURL: \\cern.ch\dfs\Applications\Altium\Datasheets\R0805_Tyco_RN73.pdf; Author: CERN DEM JLC; CreateDate: 03/12/2007; LatestRevisionDate: 13/03/2008

## Sheet conn.SchDoc
size A4; DocumentNumber: 11; SheetNumber: 11; SheetTotal: 11
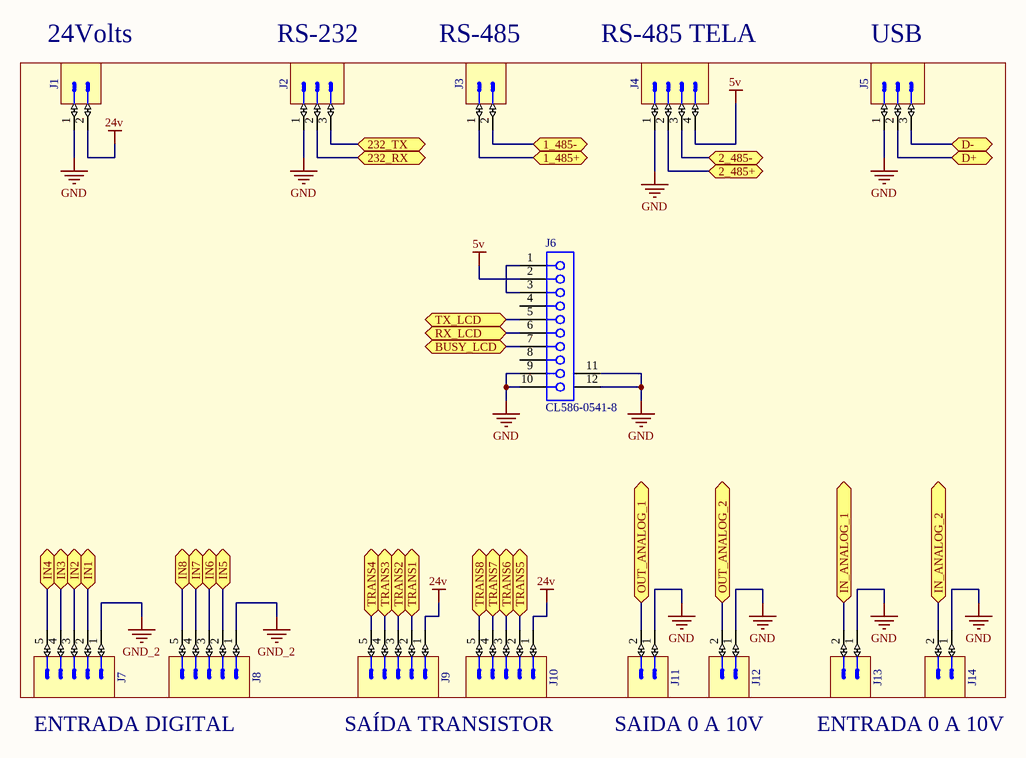
[diagram p10: conn.SchDoc]

### Parts
J1  (no value)  [PHOENIX_1757242]
J2  (no value)  [PHOENIX_1757255]
J3  (no value)  [PHOENIX_1757242]
J4  (no value)  [PHOENIX_1757268]
J5  (no value)  [PHOENIX_1757255]
J6  CL586-0541-8  [FH12-22(10)SA-1SH]
J7  (no value)  [PHOENIX_1803303]
J8  (no value)  [PHOENIX_1803303]
J9  (no value)  [PHOENIX_1803303]
J10  (no value)  [PHOENIX_1803303]
J11  (no value)  [PHOENIX_1757242]
J12  (no value)  [PHOENIX_1757242]
J13  (no value)  [PHOENIX_1757242]
J14  (no value)  [PHOENIX_1757242]

### Ports
1_485+, 1_485-, 2_485+, 2_485-, 232_RX, 232_TX, BUSY_LCD, D+, D-, IN1, IN2, IN3, IN4, IN5, IN6, IN7, IN8, IN_ANALOG_1, IN_ANALOG_2, OUT_ANALOG_1, OUT_ANALOG_2, RX_LCD, TRANS1, TRANS2, TRANS3, TRANS4, TRANS5, TRANS6, TRANS7, TRANS8, TX_LCD

### Nets
5v: J4.4 J6.2
24v: J1.2 J9.1 J10.1
GND: J1.1 J2.1 J4.1 J5.1 J6.9 J6.10 J6.11(MH1) J6.12(MH2) J11.1 J12.1 J13.1 J14.1
GND_2: J7.1 J8.1
NetD2_2: J9.4 ; port TRANS3
NetD3_2: J9.2 ; port TRANS1
NetD4_2: J9.5 ; port TRANS4
NetD5_2: J9.3 ; port TRANS2
NetD6_2: J10.2 ; port TRANS5
NetD7_2: J10.4 ; port TRANS7
NetD8_2: J10.3 ; port TRANS6
NetD9_2: J10.5 ; port TRANS8
NetIC15_1: J11.2 ; port OUT_ANALOG_1
NetIC15_7: J12.2 ; port OUT_ANALOG_2
NetJ2_2: J2.2 ; port 232_RX
NetJ2_3: J2.3 ; port 232_TX
NetJ3_1: J3.1 ; port 1_485+
NetJ3_2: J3.2 ; port 1_485-
NetJ4_2: J4.2 ; port 2_485+
NetJ4_3: J4.3 ; port 2_485-
NetJ5_2: J5.2 ; port D+
NetJ5_3: J5.3 ; port D-
NetJ6_1: J6.1 J6.3
NetJ6_5: J6.5 ; port TX_LCD
NetJ6_6: J6.6 ; port RX_LCD
NetJ6_7: J6.7 ; port BUSY_LCD
NetJ7_2: J7.2 ; port IN1
NetJ7_3: J7.3 ; port IN2
NetJ7_4: J7.4 ; port IN3
NetJ7_5: J7.5 ; port IN4
NetJ8_2: J8.2 ; port IN5
NetJ8_3: J8.3 ; port IN6
NetJ8_4: J8.4 ; port IN7
NetJ8_5: J8.5 ; port IN8
NetJ13_2: J13.2 ; port IN_ANALOG_1
NetJ14_2: J14.2 ; port IN_ANALOG_2

Not connected (* = marked no-connect by the designer): J6 4 8

### Notes on the sheet
- 24Volts
- RS-232
- RS-485
- RS-485 TELA
- USB
- ENTRADA DIGITAL
- SAÍDA TRANSISTOR
- SAIDA 0 A 10V
- ENTRADA 0 A 10V

### Library data of the parts
J1 J3 J11-J14 = PHOENIX_1757242: Connector 2 Male; Part Description: 12A, 250V, Pitch 5.08mm, 2 Positions Header; Manufacturer: PHOENIX CONTACT; Manufacturer Part Number: 1757242 (MSTBA 2,5/ 2-G-5,08); Part Number: PHOENIX_1757242; Component Kind: Standard; Component Type: Standard; Pin Count: 2; Mounted: Yes; Socket: No; SMD: No; Status: None; ComponentHeight: 8.6mm; HelpURL: \\cern.ch\dfs\Applications\Altium\Datasheets\PHOENIX_1757242.pdf; Author: CERN DEM JLC; CreateDate: 10/02/2010; LatestRevisionDate: 26/04/2010; Table: PHOENIX
J2 J5 = PHOENIX_1757255: Connector 3 Male; Part Description: 12A, 250V, Pitch 5.08mm, 3 Positions Header; Manufacturer: PHOENIX CONTACT; Manufacturer Part Number: 1757255 (MSTBA 2,5/ 3-G-5,08); Part Number: PHOENIX_1757255; Component Kind: Standard; Component Type: Standard; Pin Count: 3; Mounted: Yes; Socket: No; SMD: No; Status: None; ComponentHeight: 8.6mm; HelpURL: \\cern.ch\dfs\Applications\Altium\Datasheets\PHOENIX_1757255.pdf; Author: CERN DEM JLC; CreateDate: 10/02/2010; LatestRevisionDate: 26/04/2010; Table: PHOENIX
J4 = PHOENIX_1757268: Connector 4 Male; Part Description: 12A, 250V, Pitch 5.08mm, 4 Positions Header; Manufacturer: PHOENIX CONTACT; Manufacturer Part Number: 1757268 (MSTBA 2,5/ 4-G-5,08); Part Number: PHOENIX_1757268; Component Kind: Standard; Component Type: Standard; Pin Count: 4; Mounted: Yes; Socket: No; SMD: No; Status: None; ComponentHeight: 8.6mm; HelpURL: \\cern.ch\dfs\Applications\Altium\Datasheets\PHOENIX_1757268.pdf; Author: CERN DEM JLC; CreateDate: 10/02/2010; LatestRevisionDate: 26/04/2010; Table: PHOENIX
J6 = CL586-0541-8: FH12 Series, "Flip-Lock" SMT/ZIF FFC/FPC Connector - 1.0mm Spaced Bottom Eccentric Contact; Positions: 10; ContactMaterial: Phosphor Bronze; Current: 0.5A; PCB_Layout: Complies with manufacturer's recommendation.; Note: Pad dimensions follow nominal values, Suitable for Wave Soldering, Adjust for Re-flow.; Published: 17-Jul-2002; DatasheetVersion: 13-Nov-2000; PackageVersion: 13-Nov-2000; PackageReference: FH12-22(10)SA-1SH; Publisher: Altium Limited; ComponentLink1Description: Manufacturer Link; ComponentLink1URL: http://www.hiroseusa.com/; ComponentLink2Description: Datasheet; ComponentLink2URL: http://www.hirose.co.jp/cataloge_hp/e58605370.pdf
J7-J10 = PHOENIX_1803303: Connector 5 Male; Part Description: 8A 160 V, Pitch: 3.81mm, 5 Positions  Right Angled Header; Manufacturer: PHOENIX CONTACT; Manufacturer Part Number: 1803303 (MC 1,5/ 5-G-3,81); Part Number: PHOENIX_1803303; Component Kind: Standard; Component Type: Standard; Pin Count: 5; Mounted: Yes; Socket: No; SMD: No; Status: None; ComponentHeight: 7.25mm; HelpURL: \\cern.ch\dfs\Applications\Altium\Datasheets\PHOENIX_1803303.pdf; Author: CERN DEM JLC; CreateDate: 11/06/2013; LatestRevisionDate: 11/06/2013; Table: PHOENIX

## Nets that join several sheets
5v: Microcontrolador (13 pins), Alimentacao (C1.1 IC1.4 L1.2), Output_dig (13 pins), Output_dig2 (13 pins), Input_dig (24 pins), Comu_485 (8 pins), USB_SERIAL (C18.1 U7.4 U7.20), eeprom24c32 (C10.1 R19.2 U4.8), RTC_ds1307z (C17.1 U6.8), conn (J4.4 J6.2)
24v: Alimentacao (C2.2 C3.1 IC1.1), Output_dig (D2.1 D3.1 D4.1 D5.1), Output_dig2 (D6.1 D7.1 D8.1 D9.1), analog (IC16.1), conn (J1.2 J9.1 J10.1)
GND: Microcontrolador (12 pins), Alimentacao (6 pins), Output_dig (13 pins), Output_dig2 (13 pins), Input_dig (8 pins), Comu_485 (8 pins), USB_SERIAL (6 pins), eeprom24c32 (5 pins), RTC_ds1307z (BATH1.2 C17.2 U6.4), analog (7 pins), conn (12 pins)
GND_2: Input_dig (8 pins), conn (J7.1 J8.1)
VCC: Output_dig (IC12.14), Output_dig2 (IC21.14)
NetC19_2: Microcontrolador (J15.3 R39.1), USB_SERIAL (C19.2)
NetD2_2: Output_dig (D2.2 Q1.2), conn (J9.4)
NetD3_2: Output_dig (D3.2 Q2.2), conn (J9.2)
NetD4_2: Output_dig (D4.2 Q3.2), conn (J9.5)
NetD5_2: Output_dig (D5.2 Q4.2), conn (J9.3)
NetD6_2: Output_dig2 (D6.2 Q6.2), conn (J10.2)
NetD7_2: Output_dig2 (D7.2 Q7.2), conn (J10.4)
NetD8_2: Output_dig2 (D8.2 Q8.2), conn (J10.3)
NetD9_2: Output_dig2 (D9.2 Q9.2), conn (J10.5)
NetIC2_6: Microcontrolador (U5.56), Input_dig (IC2.6 R21.2)
NetIC3_6: Microcontrolador (U5.54), Input_dig (IC3.6 R22.2)
NetIC4_6: Microcontrolador (U5.55), Input_dig (IC4.6 R25.2)
NetIC5_6: Microcontrolador (U5.51), Input_dig (IC5.6 R26.2)
NetIC6_6: Microcontrolador (U5.52), Input_dig (IC6.6 R29.2)
NetIC7_6: Microcontrolador (U5.58), Input_dig (IC7.6 R30.2)
NetIC8_6: Microcontrolador (U5.57), Input_dig (IC8.6 R33.2)
NetIC9_6: Microcontrolador (U5.53), Input_dig (IC9.6 R34.2)
NetIC12_1: Microcontrolador (U5.59), Output_dig (IC12.1)
NetIC12_3: Microcontrolador (U5.60), Output_dig (IC12.3)
NetIC12_5: Microcontrolador (U5.71), Output_dig (IC12.5)
NetIC12_9: Microcontrolador (U5.72), Output_dig (IC12.9)
NetIC15_1: analog (IC15.1), conn (J11.2)
NetIC15_7: analog (IC15.7), conn (J12.2)
NetIC21_1: Microcontrolador (U5.73), Output_dig2 (IC21.1)
NetIC21_3: Microcontrolador (U5.74), Output_dig2 (IC21.3)
NetIC21_5: Microcontrolador (U5.75), Output_dig2 (IC21.5)
NetIC21_9: Microcontrolador (U5.76), Output_dig2 (IC21.9)
NetJ2_2: Comu_485 (U1.13), conn (J2.2)
NetJ2_3: Comu_485 (U1.14), conn (J2.3)
NetJ3_1: Comu_485 (R2.2), conn (J3.1)
NetJ3_2: Comu_485 (R4.2), conn (J3.2)
NetJ4_2: Comu_485 (R9.2), conn (J4.2)
NetJ4_3: Comu_485 (R12.2), conn (J4.3)
NetJ5_2: USB_SERIAL (R57.1), conn (J5.2)
NetJ5_3: USB_SERIAL (R55.1), conn (J5.3)
NetJ6_5: Comu_485 (R8.2), conn (J6.5)
NetJ6_6: Comu_485 (R13.2), conn (J6.6)
NetJ6_7: Microcontrolador (U5.50), conn (J6.7)
NetJ7_2: Input_dig (R23.1), conn (J7.2)
NetJ7_3: Input_dig (R27.1), conn (J7.3)
NetJ7_4: Input_dig (R31.1), conn (J7.4)
NetJ7_5: Input_dig (R35.1), conn (J7.5)
NetJ8_2: Input_dig (R24.1), conn (J8.2)
NetJ8_3: Input_dig (R28.1), conn (J8.3)
NetJ8_4: Input_dig (R32.1), conn (J8.4)
NetJ8_5: Input_dig (R36.1), conn (J8.5)
NetJ13_2: analog (R62.2), conn (J13.2)
NetJ14_2: analog (R63.2), conn (J14.2)
NetR6_1: Microcontrolador (U5.46), Comu_485 (R6.1 R8.1)
NetR10_1: Microcontrolador (U5.45), Comu_485 (R10.1 R13.1)
NetR37_2: Microcontrolador (R37.2 U5.43), eeprom24c32 (U4.6), RTC_ds1307z (U6.6)
NetR38_2: Microcontrolador (R38.2 U5.44), eeprom24c32 (U4.5), RTC_ds1307z (U6.5)
NetR54_2: Microcontrolador (U5.2), USB_SERIAL (R54.2)
NetR56_2: Microcontrolador (U5.3), USB_SERIAL (R56.2)
NetR58_1: Microcontrolador (U5.77), analog (R58.1)
NetR61_1: Microcontrolador (U5.78), analog (R61.1)
NetR62_1: Microcontrolador (U5.82), analog (R62.1 R66.2)
NetR63_1: Microcontrolador (U5.83), analog (R63.1 R67.2)
NetU2_1: Microcontrolador (U5.12), Comu_485 (U2.1)
NetU2_2: Microcontrolador (U5.15), Comu_485 (U2.2 U2.3)
NetU2_4: Microcontrolador (U5.13), Comu_485 (U2.4)
NetU3_1: Microcontrolador (U5.63), Comu_485 (U3.1)
NetU3_2: Microcontrolador (U5.70), Comu_485 (U3.2 U3.3)
NetU3_4: Microcontrolador (U5.64), Comu_485 (U3.4)